# EAGLE design board (EAGLE 4.16)
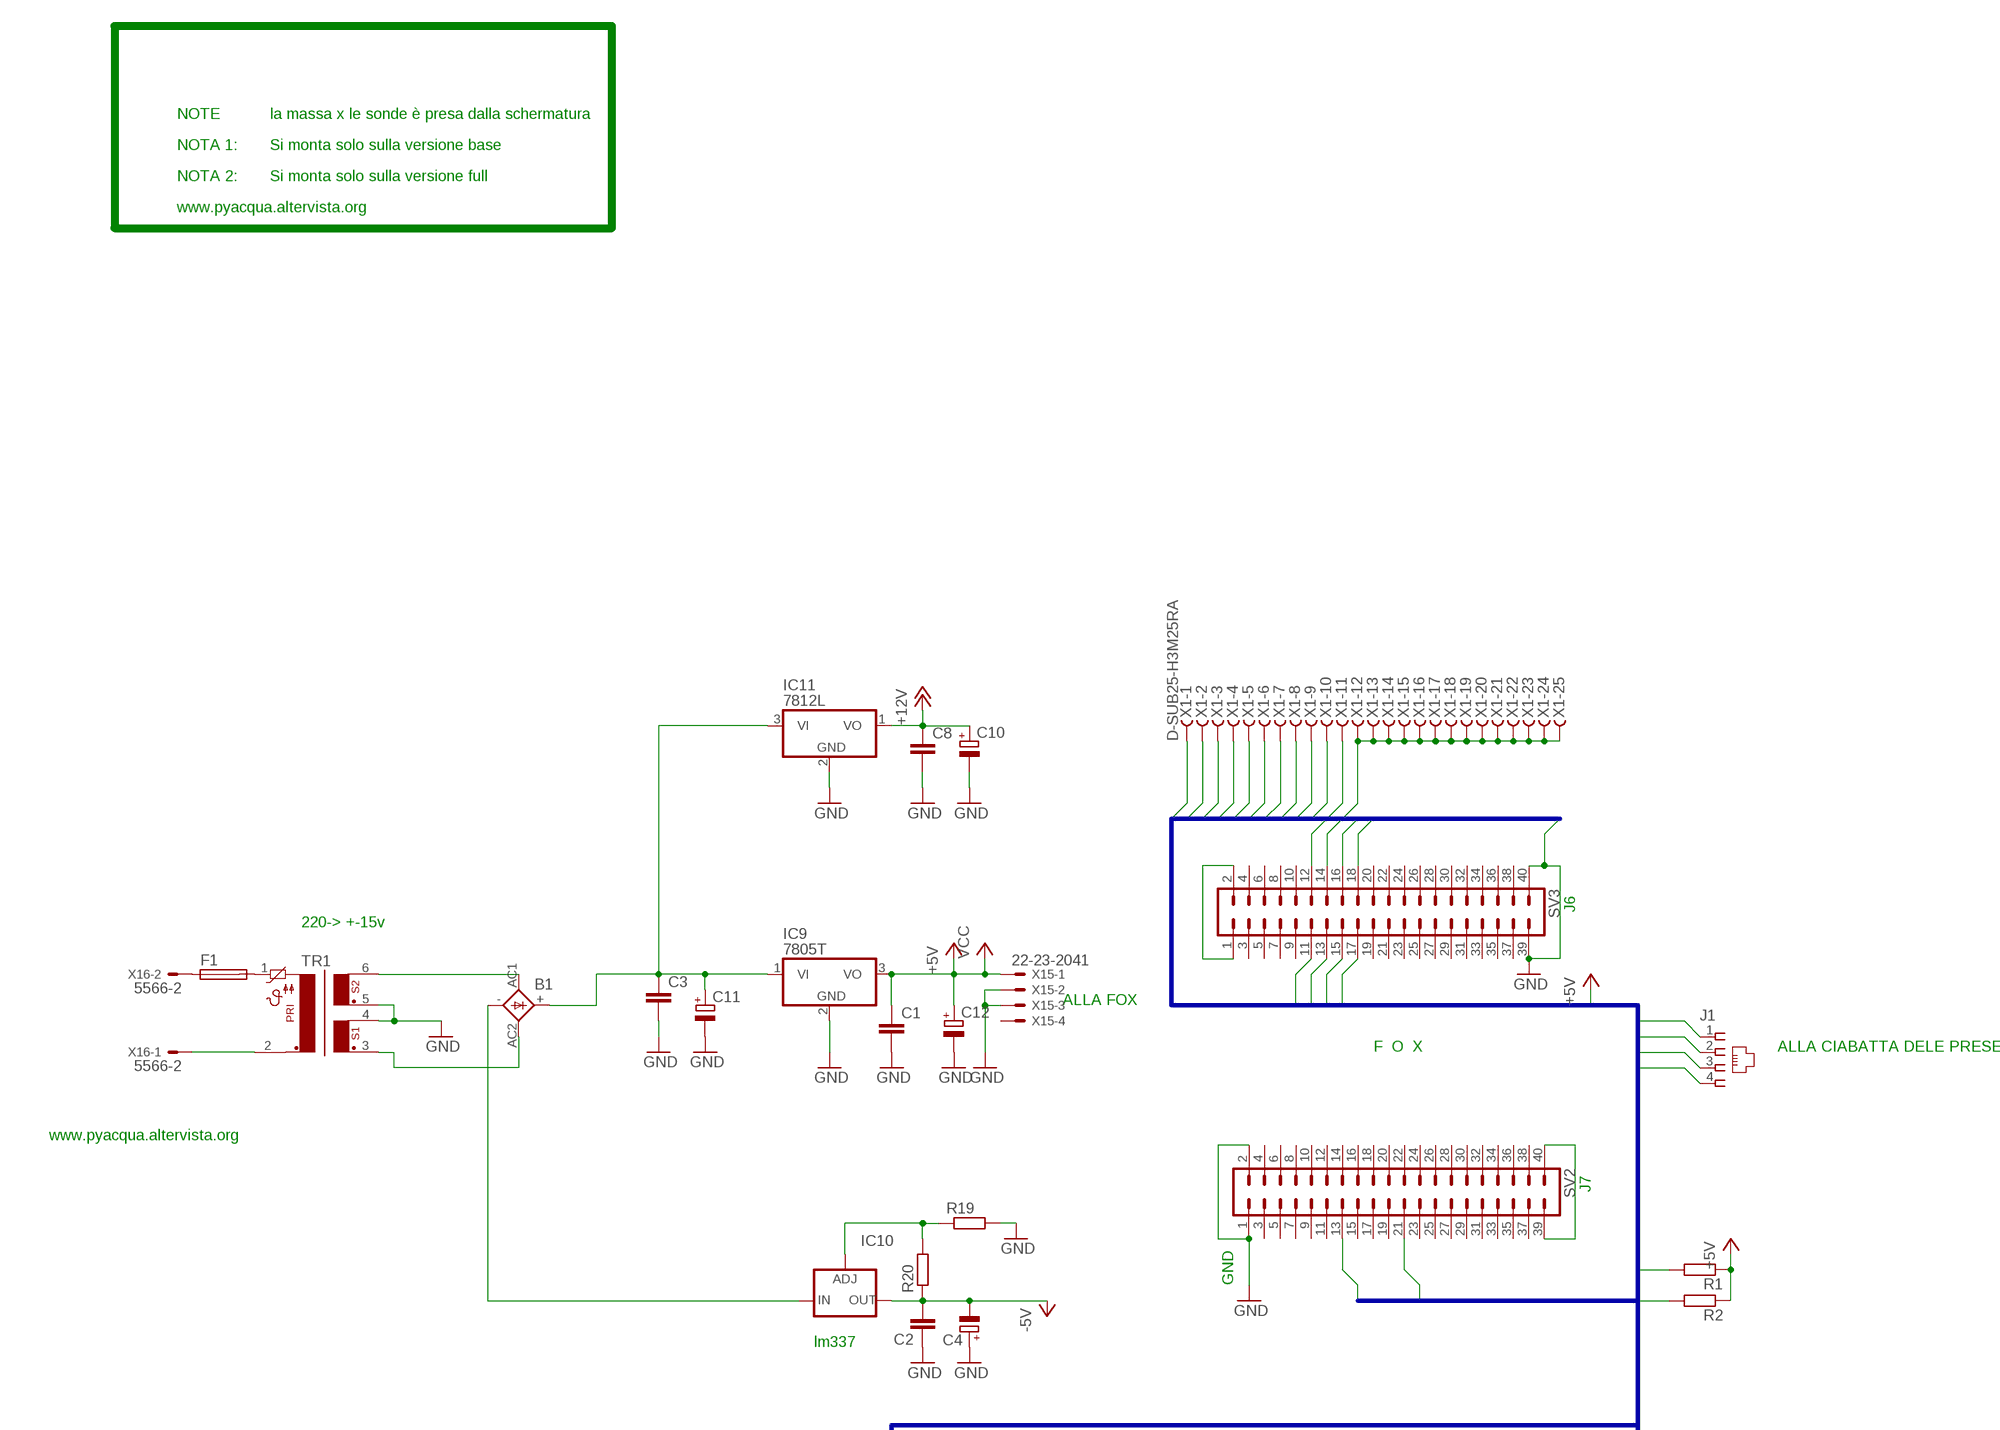
[diagram p0: schematic, sheet 1, part 1 of 3]
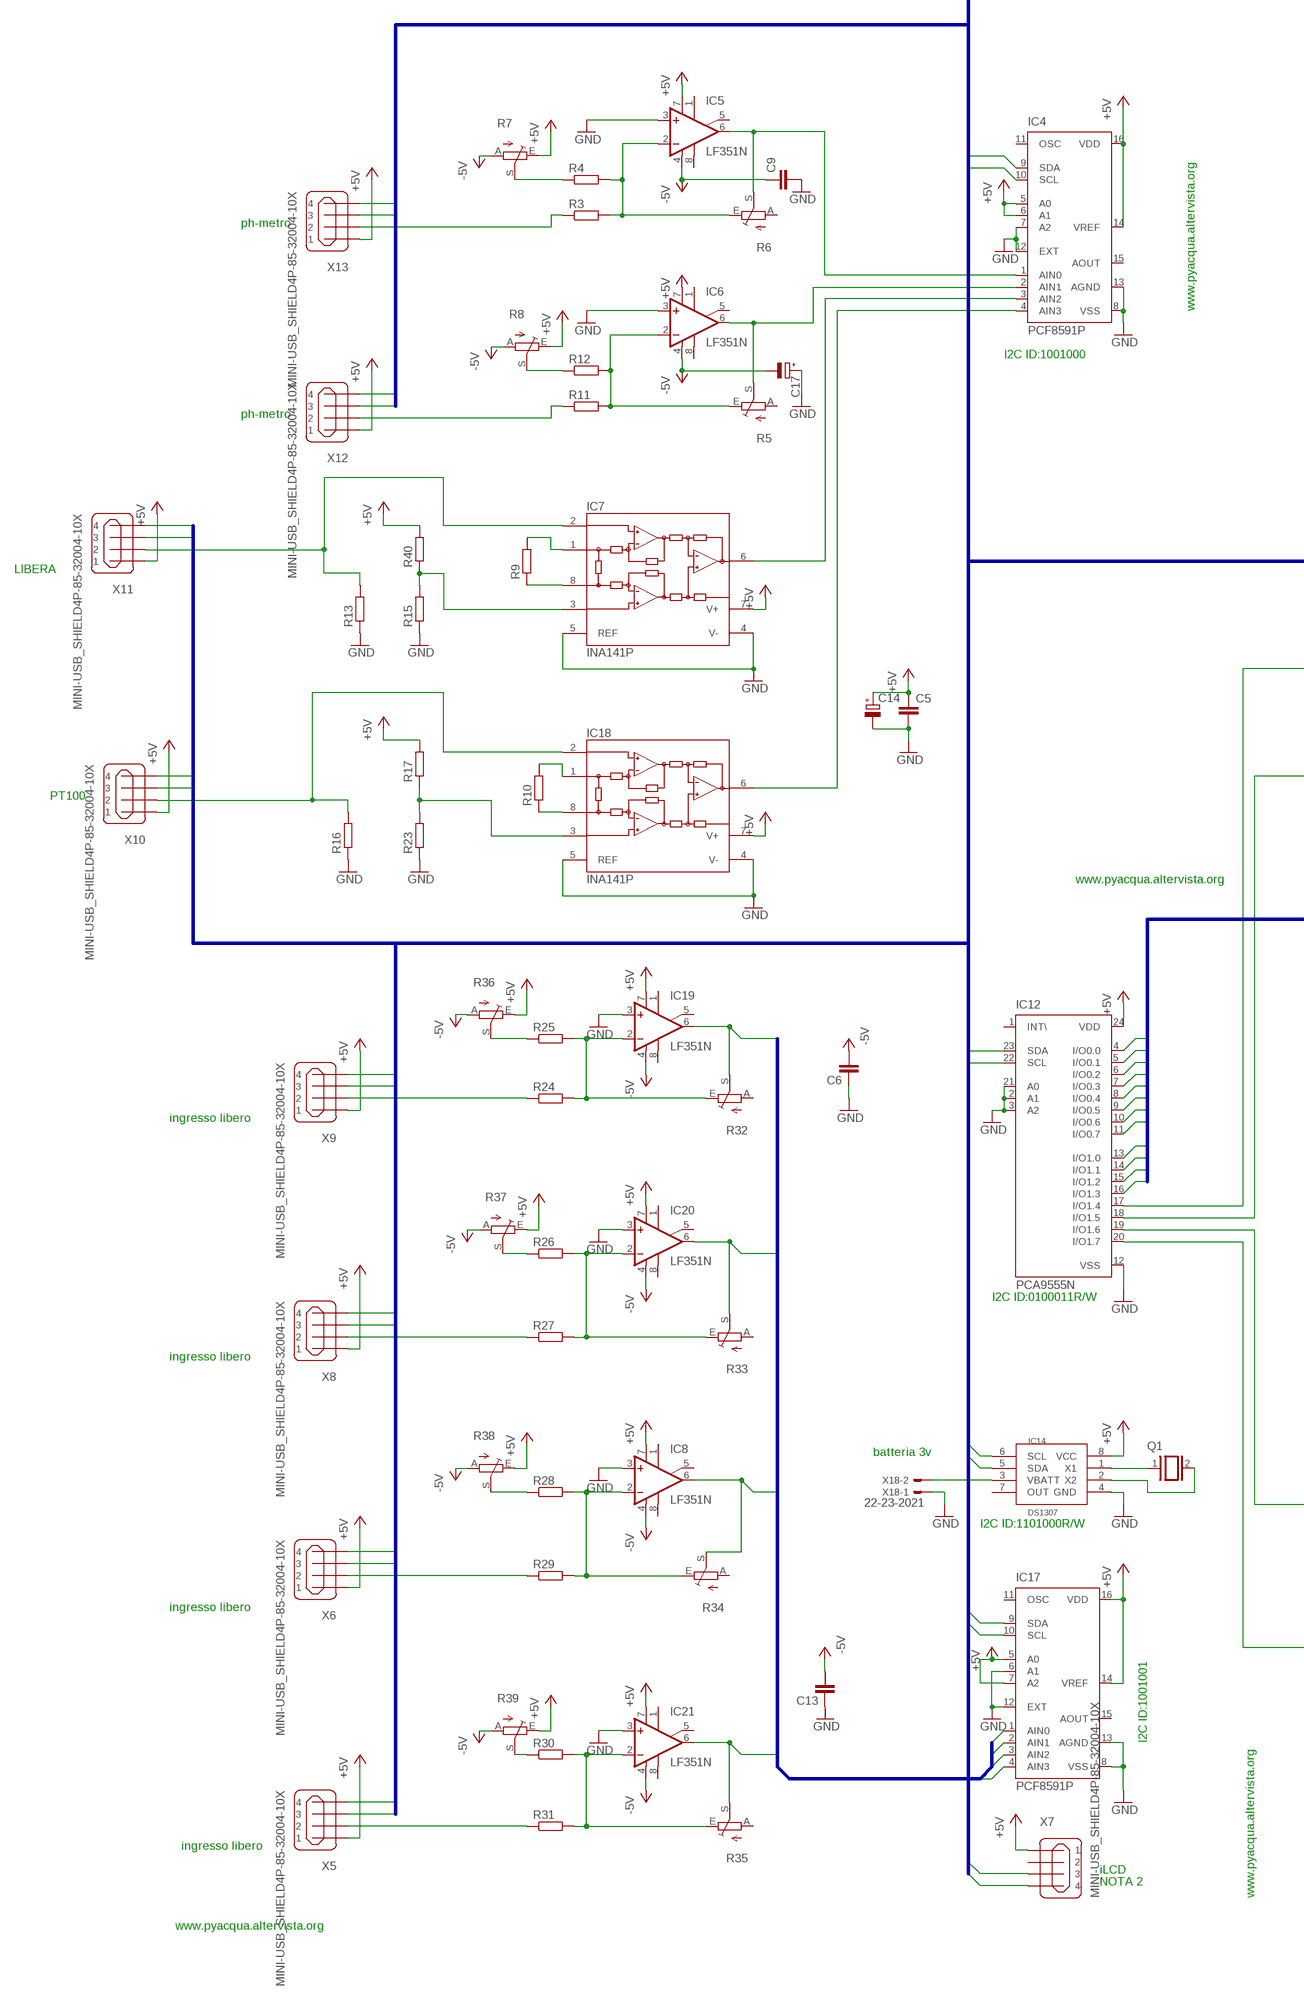
[diagram p1: schematic, sheet 1, part 2 of 3]
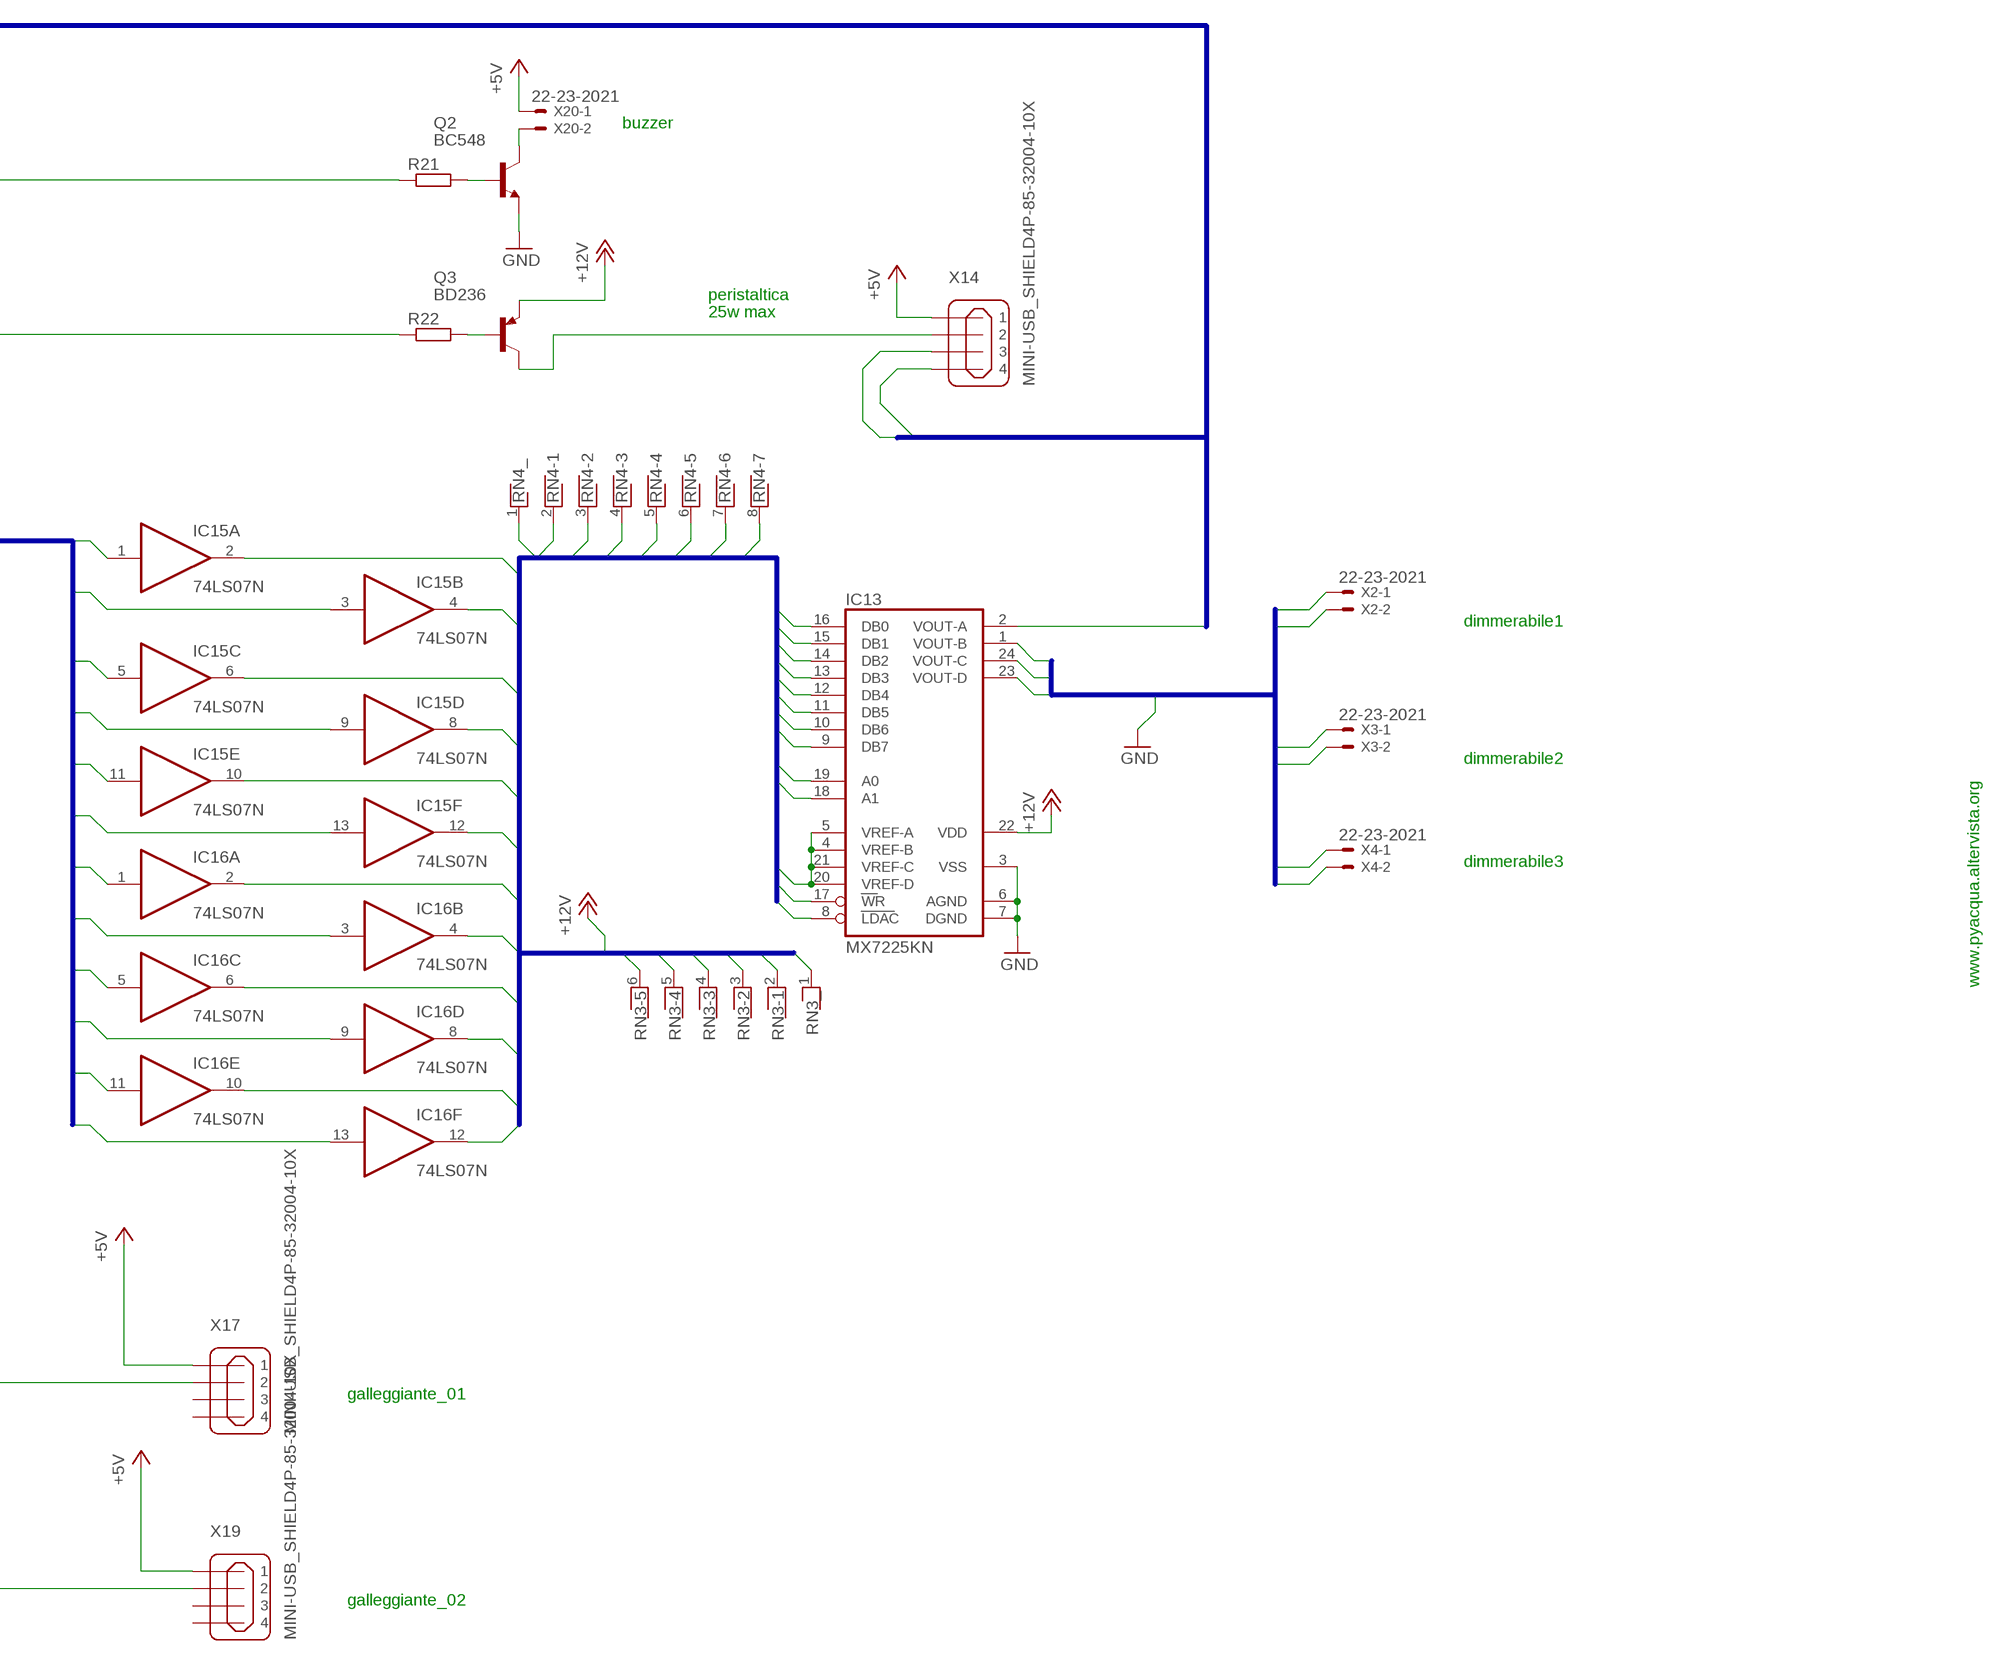
[diagram p2: schematic, sheet 1, part 3 of 3]

## Parts
B1  2KBP  [2KBP]
C1  C-EU025-040X050  [C025-040X050]
C2  C-EU025-040X050  [C025-040X050]
C3  C-EU025-040X050  [C025-040X050]
C4  CPOL-EUE2-5  [E2-5]
C5  C-EU025-040X050  [C025-040X050]
C6  C-EU025-060X050  [C025-060X050]
C8  C-EU025-050X050  [C025-050X050]
C9  C-EU025-040X050  [C025-040X050]
C10  CPOL-EUE2-5  [E2-5]
C11  CPOL-EUE2.5-6  [E2,5-6]
C12  CPOL-EUE2.5-6  [E2,5-6]
C13  C-EU025-060X050  [C025-060X050]
C14  CPOL-EUE2.5-6  [E2,5-6]
C17  CPOL-EUE2.5-6  [E2,5-6]
F1  GSH15  [GSH15]
IC4  PCF8591P  [DIL16]
IC5  LF351N  [DIL08]
IC6  LF351N  [DIL08]
IC7  INA141P  [DIL08]
IC8  LF351N  [DIL08]
IC9  7805T  [TO220H]
IC10  LM337L  [337L]
IC11  7812L  [TO92]
IC12  PCA9555N  [DIL24-6]
IC13  MX7225KN  [DIL24-6]
IC14  DS1307  [DS1307]
IC15  74LS07N  [DIL14]
IC16  74LS07N  [DIL14]
IC17  PCF8591P  [DIL16]
IC18  INA141P  [DIL08]
IC19  LF351N  [DIL08]
IC20  LF351N  [DIL08]
IC21  LF351N  [DIL08]
J1  520242-2  [520242-2]
Q1  XTAL  [Q]
Q2  BC548  [TO92-EBC]
Q3  BD236  [TO126]
R1  R-EU_0207/10  [0207/10]
R2  R-EU_0207/10  [0207/10]
R3  R-EU_0207/10  [0207/10]
R4  R-EU_0207/10  [0207/10]
R5  TRIM_EU-CT6  [CT6]
R6  TRIM_EU-CT6  [CT6]
R7  TRIM_EU-B25P  [B25P]
R8  TRIM_EU-B25P  [B25P]
R9  R-EU_0207/10  [0207/10]
R10  R-EU_0207/10  [0207/10]
R11  R-EU_0207/10  [0207/10]
R12  R-EU_0207/10  [0207/10]
R13  R-EU_0207/10  [0207/10]
R15  R-EU_0207/10  [0207/10]
R16  R-EU_0207/10  [0207/10]
R17  R-EU_0207/10  [0207/10]
R19  R-EU_0207/10  [0207/10]
R20  R-EU_0207/10  [0207/10]
R21  R-EU_0207/10  [0207/10]
R22  R-EU_0207/10  [0207/10]
R23  R-EU_0207/10  [0207/10]
R24  R-EU_0207/10  [0207/10]
R25  R-EU_0207/10  [0207/10]
R26  R-EU_0207/10  [0207/10]
R27  R-EU_0207/10  [0207/10]
R28  R-EU_0207/10  [0207/10]
R29  R-EU_0207/10  [0207/10]
R30  R-EU_0207/10  [0207/10]
R31  R-EU_0207/10  [0207/10]
R32  TRIM_EU-CT6  [CT6]
R33  TRIM_EU-CT6  [CT6]
R34  TRIM_EU-CT6  [CT6]
R35  TRIM_EU-CT6  [CT6]
R36  TRIM_EU-B25P  [B25P]
R37  TRIM_EU-B25P  [B25P]
R38  TRIM_EU-B25P  [B25P]
R39  TRIM_EU-B25P  [B25P]
R40  R-EU_0207/10  [0207/10]
RN3  RNX5  [RN-6]
RN4  RNX7  [RN-8]
SV2  MA20-2  [MA20-2]
SV3  MA20-2  [MA20-2]
TR1  PT07,5-2  [PT07,5-2]
X1  D-SUB25-H3M25RA  [H3M25RA]
X2  22-23-2021  [22-23-2021]
X3  22-23-2021  [22-23-2021]
X4  22-23-2021  [22-23-2021]
X5  MINI-USB_SHIELD4P-85-32004-10X  [85-32004-10X]
X6  MINI-USB_SHIELD4P-85-32004-10X  [85-32004-10X]
X7  MINI-USB_SHIELD4P-85-32004-10X  [85-32004-10X]
X8  MINI-USB_SHIELD4P-85-32004-10X  [85-32004-10X]
X9  MINI-USB_SHIELD4P-85-32004-10X  [85-32004-10X]
X10  MINI-USB_SHIELD4P-85-32004-10X  [85-32004-10X]
X11  MINI-USB_SHIELD4P-85-32004-10X  [85-32004-10X]
X12  MINI-USB_SHIELD4P-85-32004-10X  [85-32004-10X]
X13  MINI-USB_SHIELD4P-85-32004-10X  [85-32004-10X]
X14  MINI-USB_SHIELD4P-85-32004-10X  [85-32004-10X]
X15  22-23-2041  [22-23-2041]
X16  5566-2  [5566-2]
X17  MINI-USB_SHIELD4P-85-32004-10X  [85-32004-10X]
X18  22-23-2021  [22-23-2021]
X19  MINI-USB_SHIELD4P-85-32004-10X  [85-32004-10X]
X20  22-23-2021  [22-23-2021]

## Nets
12V: IC13.4(VREF-B) IC13.5(VREF-A) IC13.20(VREF-D) IC13.21(VREF-C) RN3.1 RN4.1 ; supply symbol labelled +12V
+5V: C1.1 C5.1 C12.+ C14.+ IC4.5(A0) IC4.6(A1) IC4.14(VREF) IC4.16(VDD) IC5.7(V+) IC6.7(V+) IC7.7(V+) IC8.7(V+) IC9.3(VO) IC12.24(VDD) IC14.8(VCC) IC17.5(A0) IC17.7(A2) IC17.14(VREF) IC17.16(VDD) IC18.7(V+) IC19.7(V+) IC20.7(V+) IC21.7(V+) R1.1 R2.1 R7.E R8.E R17.2 R36.E R37.E R38.E R39.E R40.2 X5.1 X6.1 X7.1 X8.1 X9.1 X10.1 X11.1 X12.1 X13.1 X14.1 X15.1 X17.1 X19.1 X20.1 ; supply symbol labelled VCC
+12V: C8.1 C10.+ IC11.1(VO) IC13.22(VDD)
-5V: C2.2 C4.- C6.2 C9.1 C13.2 C17.- IC5.4(V-) IC6.4(V-) IC8.4(V-) IC10.OUT IC19.4(V-) IC20.4(V-) IC21.4(V-) R7.A R8.A R20.1 R36.A R37.A R38.A R39.A
A0: IC12.13(I/O1.0) IC13.19(A0) IC16.5(C:I) IC16.6(C:O) RN4.2
A1: IC12.14(I/O1.1) IC13.18(A1) IC16.8(D:O) IC16.9(D:I) RN4.3
CH0: IC17.1(AIN0) IC21.6(OUT) R35.S
CH1: IC8.6(OUT) IC17.2(AIN1) R34.S
CH2: IC17.3(AIN2) IC20.6(OUT) R33.S
CH3: IC17.4(AIN3) IC19.6(OUT) R32.S
CONTRASTO: IC13.2(VOUT-A) X1.5
DATA0: IC13.16(DB0) IC15.2(A:O) RN4.5
DATA1: IC13.15(DB1) IC15.4(B:O) RN4.6
DATA2: IC13.14(DB2) IC15.6(C:O) RN4.7
DATA3: IC13.13(DB3) IC15.8(D:O) RN4.8
DATA4: IC13.12(DB4) IC15.10(E:O) RN3.6 SV3.14 X1.8
DATA5: IC13.11(DB5) IC15.12(F:O) RN3.5 SV3.13 X1.9
DATA6: IC13.10(DB6) IC16.2(A:O) RN3.4 SV3.11 SV3.16 X1.10
DATA7: IC13.9(DB7) IC16.4(B:O) RN3.3 SV3.15 X1.11
DB0: IC12.4(I/O0.0) IC15.1(A:I)
DB1: IC12.5(I/O0.1) IC15.3(B:I)
DB2: IC12.6(I/O0.2) IC15.5(C:I)
DB3: IC12.7(I/O0.3) IC15.9(D:I)
DB4: IC12.8(I/O0.4) IC15.11(E:I)
DB5: IC12.9(I/O0.5) IC15.13(F:I)
DB6: IC12.10(I/O0.6) IC16.1(A:I)
DB7: IC12.11(I/O0.7) IC16.3(B:I)
DIM1: IC13.1(VOUT-B) X2.1
DIM2: IC13.24(VOUT-C) X3.1
DIM3: IC13.23(VOUT-D) X4.1
E: SV3.17 X1.6
GND: C1.2 C2.1 C3.2 C4.+ C5.2 C6.1 C8.2 C9.2 C10.- C11.- C12.- C13.1 C14.- C17.+ IC4.7(A2) IC4.8(VSS) IC4.12(EXT) IC4.13(AGND) IC5.3(+IN) IC6.3(+IN) IC7.4(V-) IC7.5(REF) IC8.3(+IN) IC9.2(GND) IC11.2(GND) IC12.2(A1) IC12.3(A2) IC12.12(VSS) IC12.21(A0) IC13.3(VSS) IC13.6(AGND) IC13.7(DGND) IC14.4(GND) IC17.6(A1) IC17.8(VSS) IC17.12(EXT) IC17.13(AGND) IC18.4(V-) IC18.5(REF) IC19.3(+IN) IC20.3(+IN) IC21.3(+IN) J1.1 Q2.E R13.1 R15.1 R16.1 R19.2 R23.1 SV2.1 SV2.2 SV3.39 SV3.40 TR1.4 TR1.5 X1.3 X1.12 X1.13 X1.14 X1.15 X1.16 X1.17 X1.18 X1.19 X1.20 X1.21 X1.22 X1.23 X1.24 X1.25 X2.2 X3.2 X4.2 X15.2 X15.3 X18.1
LDAC: IC12.16(I/O1.3) IC13.8(LDAC) IC16.12(F:O) IC16.13(F:I) RN3.2
N$1: IC12.17(I/O1.4) R21.1
N$2: TR1.2 X16.1
N$3: F1.2 TR1.1
N$4: IC7.8(J) R9.1
N$5: IC7.1(J) R9.2
N$6: IC18.8(J) R10.1
N$7: IC18.1(J) R10.2
N$8: IC12.19(I/O1.6) X17.2
N$9: IC4.1(AIN0) IC5.6(OUT) R6.S
N$10: IC4.2(AIN1) IC6.6(OUT) R5.S
N$11: IC12.20(I/O1.7) X19.2
N$13: IC4.3(AIN2) IC7.6(OUT)
N$22: IC4.4(AIN3) IC18.6(OUT)
N$26: Q2.B R21.2
N$27: Q2.C X20.2
N$31: R8.S R12.1
N$35: B1.AC1 TR1.6
N$40: Q3.3(B) R22.2
N$42: Q3.1(E)
N$51: IC12.18(I/O1.5) R22.1
N$58: IC5.2(-IN) R3.2 R4.2 R6.E
N$60: R3.1 X13.2
N$61: Q3.2(C) X14.2
N$62: R4.1 R7.S
N$63: IC6.2(-IN) R5.E R11.2 R12.2
N$66: IC7.3(+IN) R15.2 R40.1
N$67: B1.- IC10.IN
N$68: IC7.2(-IN) R13.2 X11.2
N$69: R11.1 X12.2
N$70: SV3.1 SV3.2
N$71: SV2.39 SV2.40
N$74: IC14.3(VBATT) X18.2
N$76: B1.+ C3.1 C11.+ IC9.1(VI) IC11.3(VI)
N$77: IC10.ADJ R19.1 R20.2
N$80: B1.AC2 TR1.3
N$83: IC14.1(X1) Q1.1
N$84: IC14.2(X2) Q1.2
N$85: F1.1 X16.2
N$107: IC18.3(+IN) R17.1 R23.2
N$110: IC18.2(-IN) R16.2 X10.2
N$113: IC19.2(-IN) R24.2 R25.2 R32.E
N$114: IC20.2(-IN) R26.2 R27.2 R33.E
N$115: IC8.2(-IN) R28.2 R29.2 R34.E
N$116: IC21.2(-IN) R30.2 R31.2 R35.E
N$117: R31.1 X5.2
N$119: R29.1 X6.2
N$121: R30.1 R39.S
N$122: R28.1 R38.S
N$123: R26.1 R37.S
N$124: R27.1 X8.2
N$125: R24.1 X9.2
N$126: R25.1 R36.S
RS: SV3.18 X1.7
SCL: IC4.10(SCL) IC12.22(SCL) IC14.6(SCL) IC17.10(SCL) J1.2 R2.2 SV2.13 X1.2 X5.4 X6.4 X7.4 X8.4 X9.4 X10.4 X11.4 X12.4 X13.4 X14.4
SDA: IC4.9(SDA) IC12.23(SDA) IC14.5(SDA) IC17.9(SDA) J1.3 R1.2 SV2.21 X1.1 X5.3 X6.3 X7.3 X8.3 X9.3 X10.3 X11.3 X12.3 X13.3 X14.3
VCC: J1.4 SV3.12 X1.4
WR: IC12.15(I/O1.2) IC13.17(WR) IC16.10(E:O) IC16.11(E:I) RN4.4
Unconnected: IC4.11(OSC) IC4.15(AOUT) IC5.1(ON1) IC5.5(ON2) IC5.8(OPT) IC6.1(ON1) IC6.5(ON2) IC6.8(OPT) IC8.1(ON1) IC8.5(ON2) IC8.8(OPT) IC12.1(INT\) IC14.7(OUT) IC17.11(OSC) IC17.15(AOUT) IC19.1(ON1) IC19.5(ON2) IC19.8(OPT) IC20.1(ON1) IC20.5(ON2) IC20.8(OPT) IC21.1(ON1) IC21.5(ON2) IC21.8(OPT) R5.A R6.A R32.A R33.A R34.A R35.A SV2.3 SV2.4 SV2.5 SV2.6 SV2.7 SV2.8 SV2.9 SV2.10 SV2.11 SV2.12 SV2.14 SV2.15 SV2.16 SV2.17 SV2.18 SV2.19 SV2.20 SV2.22 SV2.23 SV2.24 SV2.25 SV2.26 SV2.27 SV2.28 SV2.29 SV2.30 SV2.31 SV2.32 SV2.33 SV2.34 SV2.35 SV2.36 SV2.37 SV2.38 SV3.3 SV3.4 SV3.5 SV3.6 SV3.7 SV3.8 SV3.9 SV3.10 SV3.19 SV3.20 SV3.21 SV3.22 SV3.23 SV3.24 SV3.25 SV3.26 SV3.27 SV3.28 SV3.29 SV3.30 SV3.31 SV3.32 SV3.33 SV3.34 SV3.35 SV3.36 SV3.37 SV3.38 X5.M1(S1) X5.M2(S2) X6.M1(S1) X6.M2(S2) X7.2 X7.M1(S1) X7.M2(S2) X8.M1(S1) X8.M2(S2) X9.M1(S1) X9.M2(S2) X10.M1(S1) X10.M2(S2) X11.M1(S1) X11.M2(S2) X12.M1(S1) X12.M2(S2) X13.M1(S1) X13.M2(S2) X14.M1(S1) X14.M2(S2) X15.4 X17.3 X17.4 X17.M1(S1) X17.M2(S2) X19.3 X19.4 X19.M1(S1) X19.M2(S2)

## Buses
BUS:SDA,SCL,GND,VCC,DATA[4..7],CONTRASTO,E,RS
BUS_01:DB[0..7],A[0..1],WR,LDAC
BUS_02:DATA[0..7],A[0..1],WR,LDAC,12V
AN:CH[0..3]
DIMMER:DIM[1..3],GND

## Notes on the sheet
- NOTE | la massa x le sonde è presa dalla schermatura
- NOTA 1: | Si monta solo sulla versione base
- NOTA 2: | Si monta solo sulla versione full
- www.pyacqua.altervista.org
- J6
- 220-> +-15v
- ALLA FOX
- F  O  X | ALLA CIABATTA DELE PRESE
- www.pyacqua.altervista.org
- J7
- GND
- lm337
- ph-metro
- www.pyacqua.altervista.org
- I2C ID:1001000
- ph-metro
- LIBERA
- buzzer
- peristaltica
- 25w max
- PT100
- www.pyacqua.altervista.org
- dimmerabile1
- dimmerabile2
- ingresso libero
- dimmerabile3
- www.pyacqua.altervista.org
- I2C ID:0100011R/W
- ingresso libero
- batteria 3v
- galleggiante_01
- I2C ID:1101000R/W
- ingresso libero
- galleggiante_02
- I2C ID:1001001
- ingresso libero
- iLCD
- NOTA 2
- www.pyacqua.altervista.org
- www.pyacqua.altervista.org

## Power pins joined to a net without a drawn wire
+5V: IC15.14(P:VCC) IC16.14(P:VCC)
GND: IC15.7(P:GND) IC16.7(P:GND)

## Library data of the parts
B1 = rectifier:2KBP: RECTIFIER grid 3 x 3,81 mm
C1-C3 C5 C6 C8 C9 C13 = rcl:C-EU: CAPACITOR, European symbol
C4 C10-C12 C14 C17 = rcl:CPOL-EU: POLARIZED CAPACITOR, European symbol
F1 = fuse:GSH15: FUSE HOLDER grid 15mm, 19649 Wickmann
IC4 IC17 = micro-philips:PCF8591: I2C-Bus D/A CONVERTER
IC5 IC6 IC8 IC19-IC21 = linear:LF351: OP AMP
IC7 IC18 = burr-brown:INA141: Instrumentation Amplifier Precision, Low Power, G = 10, 100
IC9 IC11 = linear:78*: Positive VOLTAGE REGULATOR Source: http://cache.national.com/ds/LM/LM78L05.pdf http://www.fairchildsemi.com/ds/LM/LM7805.pdf
IC10 = v-reg:LM337L: VOLTAGE REGULATOR
IC12 = micro-philips:PCA9555: 16-bit I2C and SMBus I/O port with interrupt Source: PCA9555_5.pdf
IC13 = maxim:MX7225KN: DIGITAL/ANALOG CONVERTER
IC14 = aggiunte:DS1307: DS1307 I2C DEVICE
IC15 IC16 = 74xx-us:74*07: Hex BUFFER, open collector high-voltage output
J1 = con-amp:520242-2: AMP connector
Q1 = special:XTAL: CRYSTAL
Q2 = transistor-npn:BC548*: NPN Transistor
Q3 = transistor-pnp:BD236: PNP Transistor
R1-R4 R9-R13 R15-R17 R19-R31 R40 = rcl:R-EU_: RESISTOR, European symbol
R5-R8 R32-R39 = pot:TRIM_EU-: POTENTIOMETER
RN3 = resistor-net:RNX5: RESISTOR NETWORK
RN4 = resistor-net:RNX7: RESISTOR NETWORK
SV2 SV3 = con-lstb:MA20-2: PIN HEADER
TR1 = trafo:PT07,5-2: TRANSFORMER 1 primary winding, temp. protection fuse, 2 secondary windings, mounting holes BLOCK
X1 = con-thomas-betts:D-SUB25-: D-Subminiatur Connector Source: Electronioc Interconnects European Edition 1998
X2-X4 X18 X20 = con-molex:22-23-2021: .100" (2.54mm) Center Header - 2 Pin
X5-X14 X17 X19 = con-cypressindustries:MINI-USB_SHIELD4P-: MINI USB 4 Pol. Source: www.cypressindustries.com
X15 = con-molex:22-23-2041: .100" (2.54mm) Center Header - 4 Pin
X16 = con-molex:5566-2: Mini FIT connector 2 pol Source: http://www.molex.com

## Board
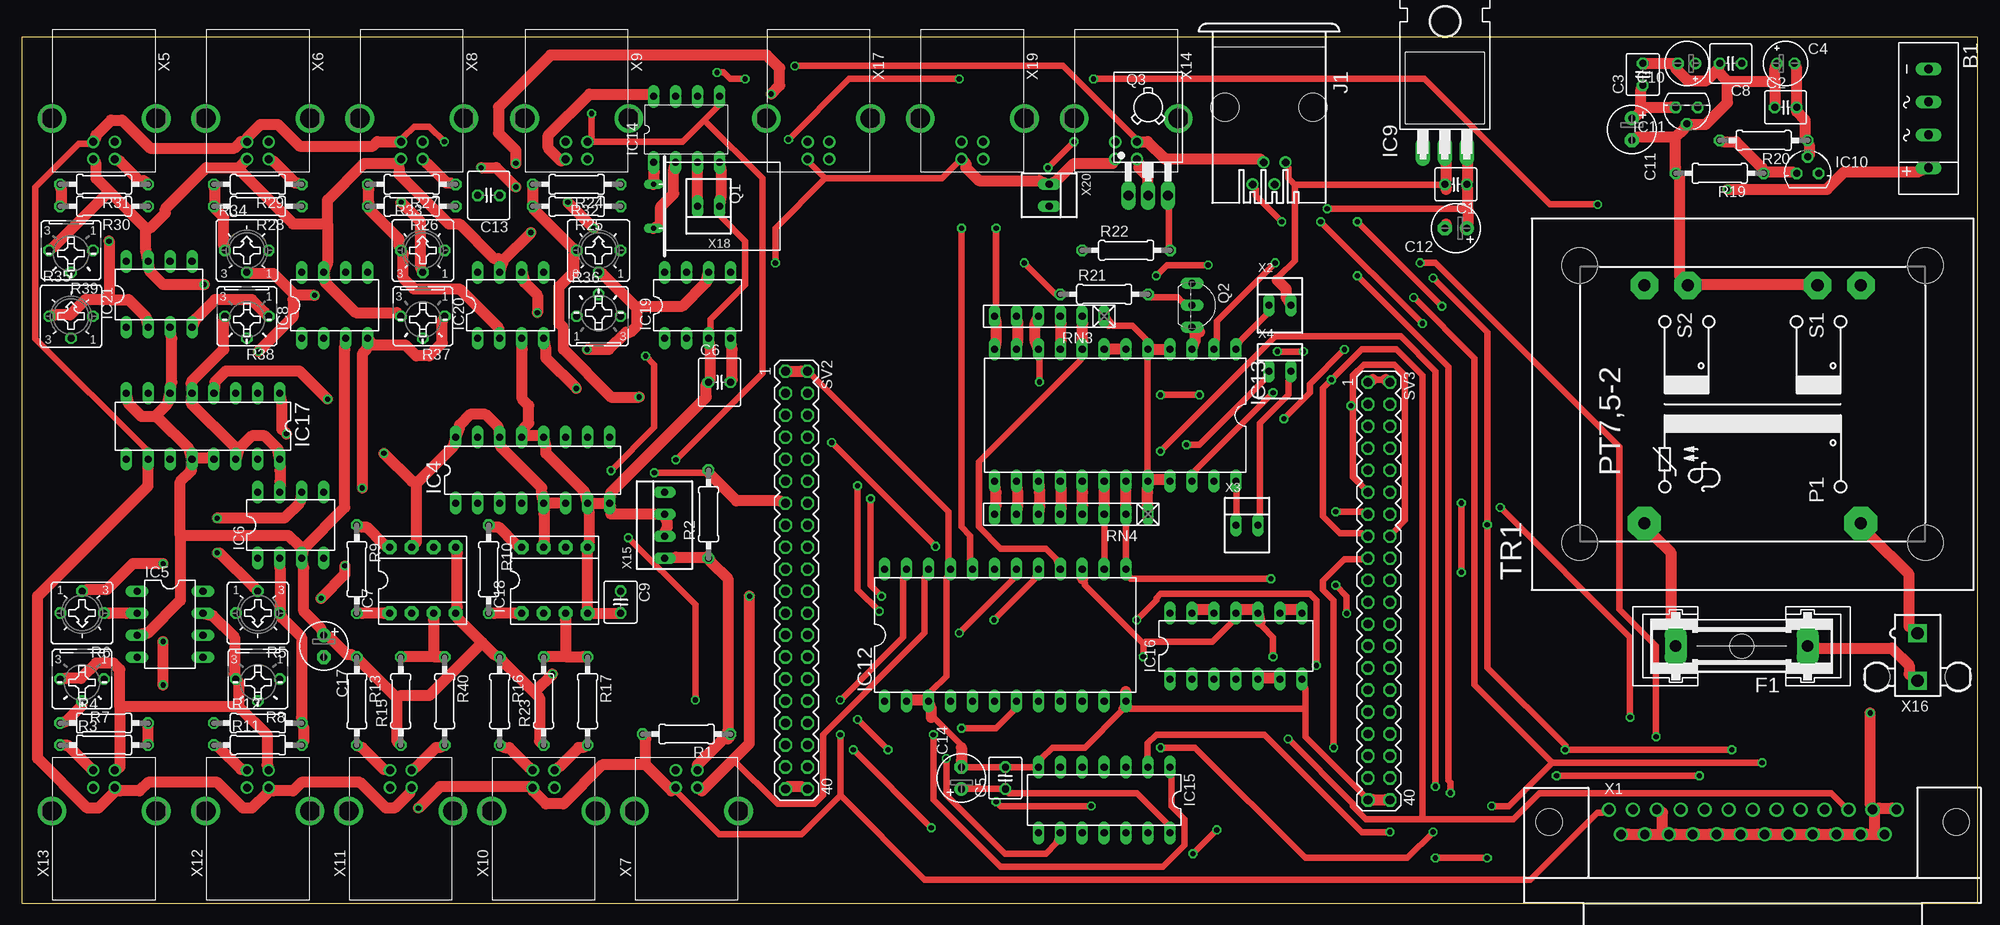
[diagram p3: board, top side]
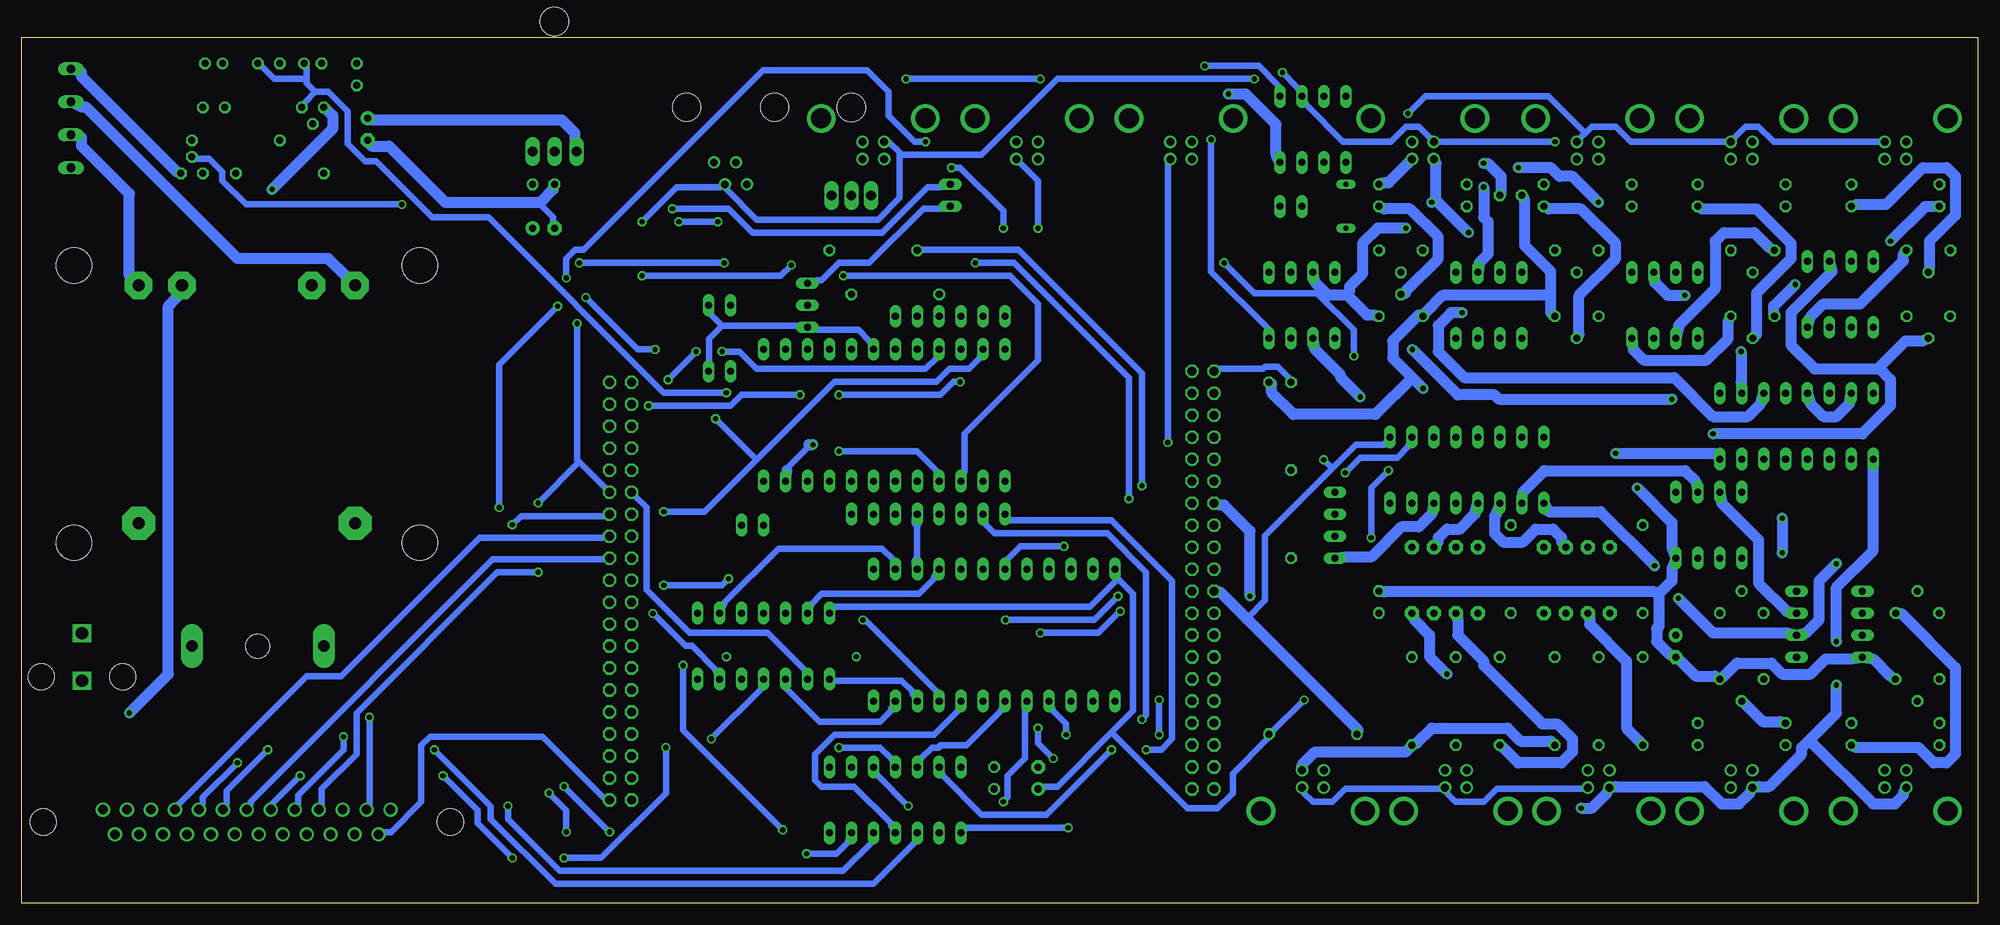
[diagram p4: board, bottom side, seen from below]

Size 226.04 x 100 mm. Coordinates in mm from the lower left corner, seen from the top.
Outline: 0,0 226.04,0 226.04,100 0,100 0,0
Copper layers (1*16): Top 0.035mm / dielectric 1.5mm / Bottom 0.035mm
Design rules "design rules": minimum track width 30mil, minimum drill 24mil, track to track 20mil, track to pad 20mil, pad to pad 20mil, via to via 20mil, smd to smd 20mil, copper to edge 40mil, drill to drill 8mil, minimum pad ring 10mil, minimum via ring 8mil, stop-mask expansion 4mil, vias tented up to drill 0mil, thermal gap 10mil

### Footprints (pad centres in the part's own frame; a part is rotated, then mirrored left to right if it is on the bottom)
2KBP = drill 1.016 long: + 5.715,0; - -5.715,0; AC1 -1.905,0; AC2 1.905,0
C025-040X050 = drill 0.813 octagon: 1 -1.27,0; 2 1.27,0
E2-5 = drill 0.813 pad 1.27 round: + -1.016,0 | drill 0.813 pad 1.27 octagon: - 1.016,0
C025-060X050 = drill 0.813 octagon: 1 -1.27,0; 2 1.27,0
C025-050X050 = drill 0.813 octagon: 1 -1.27,0; 2 1.27,0
E2,5-6 = drill 0.813 pad 1.6 round: + -1.27,0 | drill 0.813 pad 1.6 octagon: - 1.27,0
GSH15 = drill 1.321 pad 2.54 long: 1 -7.62,0; 2 7.62,0 | hole 2.794: 0,0
DIL16 = drill 0.813 long: 1 -8.89,-3.81; 2 -6.35,-3.81; 3 -3.81,-3.81; 4 -1.27,-3.81; 5 1.27,-3.81; 6 3.81,-3.81; 7 6.35,-3.81; 8 8.89,-3.81; 9 8.89,3.81; 10 6.35,3.81; 11 3.81,3.81; 12 1.27,3.81; 13 -1.27,3.81; 14 -3.81,3.81; 15 -6.35,3.81; 16 -8.89,3.81
DIL08 = drill 0.813 long: 1 -3.81,-3.81; 2 -1.27,-3.81; 3 1.27,-3.81; 4 3.81,-3.81; 5 3.81,3.81; 6 1.27,3.81; 7 -1.27,3.81; 8 -3.81,3.81
DIL08' = drill 0.813 pad 1.6 octagon: 1 -3.81,-3.81; 2 -1.27,-3.81; 3 1.27,-3.81; 4 3.81,-3.81; 5 3.81,3.81; 6 1.27,3.81; 7 -1.27,3.81; 8 -3.81,3.81
TO220H = drill 1.118 long: 1 -2.54,-10.16; 2 0,-10.16; 3 2.54,-10.16 | hole 3.302: 0,4.826
337L = drill 0.813 octagon: ADJ -1.27,0; IN 1.27,0; OUT 0,1.905
TO92 = drill 0.813 octagon: 1 -1.27,0; 2 0,1.905; 3 1.27,0
DIL24-6 = drill 0.813 long: 1 -13.97,-7.62; 2 -11.43,-7.62; 3 -8.89,-7.62; 4 -6.35,-7.62; 5 -3.81,-7.62; 6 -1.27,-7.62; 7 1.27,-7.62; 8 3.81,-7.62; 9 6.35,-7.62; 10 8.89,-7.62; 11 11.43,-7.62; 12 13.97,-7.62; 13 13.97,7.62; 14 11.43,7.62; 15 8.89,7.62; 16 6.35,7.62; 17 3.81,7.62; 18 1.27,7.62; 19 -1.27,7.62; 20 -3.81,7.62; 21 -6.35,7.62; 22 -8.89,7.62; 23 -11.43,7.62; 24 -13.97,7.62
DS1307 = drill 0.8 long: 1 -8.89,-5.08; 2 -6.35,-5.08; 3 -3.81,-5.08; 4 -1.27,-5.08; 5 -1.27,2.54; 6 -3.81,2.54; 7 -6.35,2.54; 8 -8.89,2.54
DIL14 = drill 0.813 long: 1 -7.62,-3.81; 2 -5.08,-3.81; 3 -2.54,-3.81; 4 0,-3.81; 5 2.54,-3.81; 6 5.08,-3.81; 7 7.62,-3.81; 8 7.62,3.81; 9 5.08,3.81; 10 2.54,3.81; 11 0,3.81; 12 -2.54,3.81; 13 -5.08,3.81; 14 -7.62,3.81
520242-2 = drill 0.889 round: 1 -1.905,6.35; 2 -0.635,8.89; 3 0.635,6.35; 4 1.905,8.89 | hole 3.251: -5.08,0; 5.08,0
Q = drill 0.61 long: 1 -2.54,-7.62; 2 2.54,-7.62
TO92-EBC = drill 0.813 long: B 0,-1.27; C -2.54,-1.27; E 2.54,-1.27
TO126 = drill 1.118 long: 1 -2.286,-5.08; 2 0,-5.08; 3 2.286,-5.08 | hole 3.302: 0,5.08
0207/10 = drill 0.813 octagon: 1 -5.08,0; 2 5.08,0
CT6 = drill 0.813 octagon: A 2.515,0; E -2.515,0; S 0,-2.54
B25P = drill 0.813 octagon: A -2.54,0; E 2.54,0; S 0,2.54
RN-6 = drill 0.813 long: 1 -6.35,0; 2 -3.81,0; 3 -1.27,0; 4 1.27,0; 5 3.81,0; 6 6.35,0
RN-8 = drill 0.813 long: 1 -8.89,0; 2 -6.35,0; 3 -3.81,0; 4 -1.27,0; 5 1.27,0; 6 3.81,0; 7 6.35,0; 8 8.89,0
MA20-2 = drill 1.016 octagon: 1 -24.13,-1.27; 2 -24.13,1.27; 3 -21.59,-1.27; 4 -21.59,1.27; 5 -19.05,-1.27; 6 -19.05,1.27; 7 -16.51,-1.27; 8 -16.51,1.27; 9 -13.97,-1.27; 10 -13.97,1.27; 11 -11.43,-1.27; 12 -11.43,1.27; 13 -8.89,-1.27; 14 -8.89,1.27; 15 -6.35,-1.27; 16 -6.35,1.27; 17 -3.81,-1.27; 18 -3.81,1.27; 19 -1.27,-1.27; 20 -1.27,1.27; 21 1.27,-1.27; 22 1.27,1.27; 23 3.81,-1.27; 24 3.81,1.27; 25 6.35,-1.27; 26 6.35,1.27; 27 8.89,-1.27; 28 8.89,1.27; 29 11.43,-1.27; 30 11.43,1.27; 31 13.97,-1.27; 32 13.97,1.27; 33 16.51,-1.27; 34 16.51,1.27; 35 19.05,-1.27; 36 19.05,1.27; 37 21.59,-1.27; 38 21.59,1.27; 39 24.13,-1.27; 40 24.13,1.27
PT07,5-2 = drill 1.397 pad 3.81 octagon: 1 -13.741,12.497; 2 -13.741,-12.497 | drill 1.397 pad 3.175 octagon: 3 13.741,-12.497; 4 13.741,-7.493; 5 13.741,7.493; 6 13.741,12.497 | hole 4.115: -16.002,-19.99; 16.002,-19.99; 16.002,19.99; -16.002,19.99
H3M25RA = drill 1.092 round: 1 -16.612,1.422; 2 -13.843,1.422; 3 -11.074,1.422; 4 -8.306,1.422; 5 -5.537,1.422; 6 -2.769,1.422; 7 0,1.422; 8 2.769,1.422; 9 5.537,1.422; 10 8.306,1.422; 11 11.074,1.422; 12 13.843,1.422; 13 16.612,1.422; 14 -15.227,-1.422; 15 -12.459,-1.422; 16 -9.69,-1.422; 17 -6.921,-1.422; 18 -4.153,-1.422; 19 -1.384,-1.422; 20 1.384,-1.422; 21 4.153,-1.422; 22 6.921,-1.422; 23 9.69,-1.422; 24 12.459,-1.422; 25 15.227,-1.422 | hole 3.048: -23.52,0; 23.52,0
22-23-2021 = drill 0.813 long: 1 -1.27,0; 2 1.27,0
85-32004-10X = drill 0.92 pad 1.27 round: 1 4.71,-1.25; 2 4.71,1.25; 3 2.71,1.25; 4 2.71,-1.25 | drill 2.3 pad 3 round: M1 0,6.02; M2 0,-6.02
22-23-2041 = drill 0.813 long: 1 -3.81,0; 2 -1.27,0; 3 1.27,0; 4 3.81,0
5566-2 = drill 1.4 square: 1 0,-2.75; 2 0,2.75 | hole 3: 4.7,2.29; -4.7,2.29

### Placement (x,y rotation side)
B1  220.34,90.64 270 top
C1  165.73,83.02 180 top
C2  203.83,91.91 0 top
C3  187.32,95.72 90 top
C4  203.83,96.99 0 top
C5  113.66,14.44 90 top
C6  80.64,60.16 0 top
C8  197.48,96.99 180 top
C9  69.21,34.76 270 top
C10  192.4,96.99 180 top
C11  186.05,89.37 270 top
C12  165.73,77.94 180 top
C13  53.97,81.75 180 top
C14  108.58,14.44 90 top
C17  34.92,29.68 270 top
F1  198.75,29.68 180 top
IC4  59.05,50 0 top
IC5  17.14,32.22 270 top
IC6  31.11,43.65 0 top
IC7  INA141P  [DIL08']  46.35,37.3 0 top
IC8  36.19,69.05 0 top
IC9  164.46,96.99 0 top
IC10  206.37,84.29 0 top
IC11  192.4,91.91 180 top
IC12  113.66,30.95 0 top
IC13  126.36,56.35 180 top
IC14  81.91,90.64 0 top
IC15  125.09,11.9 180 top
IC16  140.33,29.68 0 top
IC17  20.95,55.08 180 top
IC18  INA141P  [DIL08']  61.59,37.3 0 top
IC19  78.1,69.05 0 top
IC20  56.51,69.05 0 top
IC21  15.87,70.32 0 top
J1  144.14,91.91 180 top
Q1  80.64,80.48 270 top
Q2  136.52,69.05 270 top
Q3  130.17,86.83 0 top
R1  76.83,19.52 180 top
R2  79.37,44.92 90 top
R3  9.52,18.25 0 top
R4  9.52,20.79 0 top
R5  27.3,33.49 180 top
R6  6.98,33.49 180 top
R7  6.98,25.87 180 top
R8  27.3,25.87 180 top
R9  38.73,38.57 270 top
R10  53.97,38.57 270 top
R11  27.3,18.25 0 top
R12  27.3,20.79 0 top
R13  38.73,23.33 270 top
R15  43.81,23.33 90 top
R16  55.24,23.33 270 top
R17  65.4,23.33 270 top
R19  196.21,84.29 180 top
R20  201.29,88.1 180 top
R21  125.09,70.32 0 top
R22  127.63,75.4 0 top
R23  60.32,23.33 90 top
R24  64.13,83.02 180 top
R25  64.13,80.48 180 top
R26  45.08,80.48 180 top
R27  45.08,83.02 180 top
R28  27.3,80.48 180 top
R29  27.3,83.02 180 top
R30  9.52,80.48 180 top
R31  9.52,83.02 180 top
R32  66.67,75.4 0 top
R33  46.35,75.4 0 top
R34  26.03,75.4 0 top
R35  5.71,67.78 0 top
R36  66.67,67.78 0 top
R37  46.35,67.78 180 top
R38  26.03,67.78 180 top
R39  5.71,75.4 180 top
R40  48.89,23.33 270 top
RN3  118.74,67.78 180 top
RN4  121.28,44.92 180 top
SV2  89.53,37.3 270 top
SV3  156.84,36.03 270 top
TR1  200.02,57.62 90 top
X1  200.02,9.36 0 top
X2  145.41,69.05 0 top
X3  141.6,43.65 0 top
X4  145.41,61.43 0 top
X5  9.52,90.64 270 top
X6  27.3,90.64 270 top
X7  76.83,10.63 90 top
X8  45.08,90.64 270 top
X9  64.13,90.64 270 top
X10  60.32,10.63 90 top
X11  43.81,10.63 90 top
X12  27.3,10.63 90 top
X13  9.52,10.63 90 top
X14  127.63,90.64 270 top
X15  74.29,43.65 90 top
X16  219.07,28.41 180 top
X17  92.07,90.64 270 top
X18  79.37,80.48 180 top
X19  109.85,90.64 270 top
X20  118.74,81.75 270 top

### Tracks (layer width: path | path; a pad name or v marks a point on that pad's centre or on a via)
12V
  Top 0.762: 125.6,66.95 126.1,66.7 128.35,66.7 129.85,65.2 IC13.5 130.1,62.7 130.1,49.95 IC13.20
  Top 1.27: 125.6,66.95 RN3.1 | IC13.4 132.1,63.95 130.6,63.95 IC13.5 | IC13.21 132.1,48.95 130.6,48.95 IC13.20 130.1,47.45 130.1,45.95 RN4.1
+5V  (via drill 0.61)
  Top 0.762: C14.+ 109.35,13.2 113.1,13.2 C5.1 114.1,12.7 128.85,12.7 132.35,9.2 IC15.14 | 92.85,83.7 91.1,85.45 X17.1 | 92.85,83.7 106.35,83.7 108.1,85.45 X19.1 | v150.85,80.2 167.1,80.2 | v77.85,23.45 77.85,34.45 v70.1,42.2 | v68.1,49.95 73.1,54.95 73.1,62.2 v72.1,63.2 | v87.1,73.95 87.1,77.95 92.85,83.7
  Top 1.27: R40.2 48.35,17.95 47.85,17.95 45.6,15.7 X11.1 | R17.2 64.85,17.95 64.35,17.95 62.1,15.7 X10.1 | IC4.5 60.85,46.2 62.35,46.2 IC4.6 | IC18.7 60.35,41.7 60.35,44.95 IC4.5 | 45.6,48.45 45.6,41.7 IC7.7 | 45.6,48.45 49.85,52.7 IC4.16 50.6,54.95 50.6,55.2 51.85,56.45 53.6,56.45 55.1,54.95 IC4.14 55.35,52.7 60.1,47.95 60.1,47.45 IC4.5 | 55.6,74.2 55.6,73.95 IC20.7 | 55.6,74.2 v58.85,77.45 | 11.35,22.7 11.35,15.7 X13.1 | 11.35,22.7 11.35,26.95 10.6,27.7 8.6,27.7 6.85,25.95 5.1,25.95 R7.E | IC5.7 22.1,33.2 24.6,30.7 24.6,26.45 R8.E 25.1,25.45 25.1,22.7 | 25.1,22.7 28.35,19.45 28.35,15.95 X12.1 | 25.1,22.7 11.35,22.7 | 25.1,52.45 26.6,53.95 28.1,53.95 29.6,52.45 IC17.16 29.85,49.95 29.85,48.7 IC6.7 | 25.1,52.45 IC17.14 | R38.E 23.35,67.2 23.35,63.95 19.6,60.2 IC17.5 19.6,57.7 24.6,52.7 25.1,52.45 | R37.E 43.35,68.2 38.6,68.2 35.1,71.7 IC8.7 35.35,73.95 35.35,78.45 | 43.35,85.45 39.6,85.45 35.35,81.2 35.35,78.45 | 43.35,85.45 X8.1 | 14.35,77.95 14.35,75.45 IC21.7 14.85,72.95 16.35,71.45 v21.1,71.45 | 10.1,82.2 8.6,83.7 8.6,85.45 X5.1 | 14.35,77.95 10.1,82.2 | R39.E 3.6,75.7 10.1,82.2 | 25.1,84.95 25.6,85.45 X6.1 | 25.1,84.95 21.35,84.95 16.6,80.2 16.6,79.7 14.85,77.95 14.35,77.95 | 35.35,78.45 31.35,78.45 25.35,84.45 25.1,84.95 | 55.6,74.2 55.1,74.45 54.6,74.45 50.6,78.45 49.35,78.45 43.6,84.2 43.6,84.95 43.35,85.45 | v41.85,51.95 45.1,48.7 45.6,48.45 | IC14.8 72.6,93.45 65.6,93.45 60.85,88.7 60.85,87.2 62.35,85.7 X9.1 | v63.1,80.95 v66.1,77.95 | 78.1,15.45 X7.1 78.1,15.95 81.1,18.95 81.6,18.95 R1.1 81.6,19.95 81.6,37.45 79.6,39.45 R2.1 79.1,39.95 75.6,39.95 X15.1 | X19.1 109.1,85.45 109.1,84.95 110.6,83.45 117.6,83.45 X20.1 119.6,83.45 121.6,85.45 126.1,85.45 X14.1
  Top 1.27: IC9.3 167.1,85.45 167.1,83.45 C1.1 167.1,82.45 167.1,80.2 167.1,78.45 C12.+
  Bottom 0.762: 99.35,37.45 97.6,35.7 97.6,22.2 100.1,19.7 | 100.1,19.7 106.35,13.45 107.85,13.45 C14.+ | 99.35,37.45 IC12.24 | IC16.14 132.1,34.2 102.6,34.2 99.35,37.45 | 100.1,19.7 91.35,10.95 87.85,10.95 86.1,12.7 86.1,14.95 82.1,18.95 R1.1 81.6,19.7 v77.85,23.45 | v150.85,80.2 144.35,80.2 141.6,77.45 126.6,77.45 121.35,82.7 119.85,82.7 X20.1 | v70.1,42.2 70.1,47.95 v68.1,49.95 | v72.1,63.2 72.1,66.2 76.35,70.45 83.6,70.45 v87.1,73.95
  Bottom 1.27: R40.2 49.35,18.7 52.85,18.7 54.35,20.2 63.1,20.2 64.85,18.45 R17.2 65.6,17.95 66.1,17.45 76.6,17.45 78.1,15.95 X7.1 | 72.85,70.2 70.6,67.95 69.85,67.95 R36.E | 72.85,70.2 75.1,70.2 76.6,71.7 IC19.7 | v58.85,77.45 62.6,81.2 | 62.6,81.2 62.6,85.45 X9.1 | IC17.7 14.85,57.7 16.35,56.2 17.85,56.2 19.35,57.7 IC17.5 | v21.1,71.45 23.6,68.95 23.6,68.2 R38.E | IC5.7 22.1,33.7 25.35,36.95 25.35,41.95 29.6,46.2 IC6.7 | v41.85,51.95 30.35,51.95 IC17.16 | v66.1,77.95 69.35,77.95 71.1,76.2 71.1,72.7 72.6,71.2 72.6,70.7 72.85,70.2 | 62.6,81.2 v63.1,80.95 | X15.1 73.1,39.95 70.1,39.95 66.6,43.45 64.6,43.45 63.1,44.95 IC4.6
+12V  (via drill 0.61)
  Top 0.762: v144.6,58.95 135.6,49.95 IC13.22
  Bottom 0.762: v144.6,58.95 151.85,58.95 172.1,79.2 178.6,79.2 185.1,85.7 186.35,85.7 188.35,87.7 188.35,91.45 190.6,93.7 192.1,93.7 | 192.1,93.7 193.35,92.45 IC11.1 | 193.1,95.2 193.1,94.7 192.1,93.7 | 193.1,95.2 193.1,96.45 C10.+ | C8.1 198.35,96.7 196.85,95.2 193.1,95.2
-5V  (via drill 0.61)
  Top 0.762: v182.1,80.7 176.6,80.7 162.1,95.2 v123.85,95.2 | v108.35,95.2 95.6,95.2 v88.6,88.2
  Top 1.27: IC21.4 20.1,67.45 22.35,69.7 26.6,69.7 28.1,68.2 R38.A | R37.A 48.6,67.2 48.6,64.7 47.1,63.2 45.6,63.2 44.35,64.45 40.6,64.45 IC8.4 39.85,63.95 39.35,63.45 v39.35,47.95 | v64.1,59.45 60.6,62.95 60.6,63.95 IC20.4 | IC10.OUT 206.6,86.45 206.6,87.45 R20.1 206.1,88.45 206.1,90.45 205.1,91.45 C2.2 205.1,96.45 C4.- | IC19.4 82.1,63.95 82.1,60.45 C6.2
  Bottom 0.762: v182.1,80.7 200.1,80.7 202.85,83.45 202.85,84.45 204.35,85.95 205.85,85.95 IC10.OUT | v108.35,95.2 v123.85,95.2 | v88.6,88.2 88.6,72.95 82.1,66.45 IC19.4
  Bottom 1.27: R7.A 10.1,26.2 12.1,28.2 IC5.4 14.6,28.2 17.6,28.2 19.35,26.45 22.6,26.45 23.85,27.7 27.85,27.7 29.35,26.2 R8.A 30.35,26.2 32.6,26.2 34.35,27.95 C17.- 35.6,28.7 37.1,30.2 37.1,31.7 36.85,31.95 36.85,35.7 | 36.85,35.7 35.35,37.2 35.35,38.7 IC6.4 35.35,40.95 35.35,43.95 v39.35,47.95 | C9.1 68.6,35.95 37.35,35.95 36.85,35.7 | R39.A 8.6,74.95 8.6,74.2 13.6,69.2 17.85,69.2 19.35,67.7 IC21.4 | 49.35,70.2 49.35,68.2 R37.A | 49.35,70.2 49.35,72.95 52.35,75.95 52.35,81.2 C13.2 | R38.A 28.85,67.2 28.85,65.2 31.35,62.7 38.6,62.7 39.85,63.95 IC8.4 | 49.35,70.2 61.85,70.2 63.85,68.2 R36.A 64.6,67.95 67.6,64.95 67.6,62.95 65.35,60.7 | 65.35,60.7 v64.1,59.45 | C6.2 81.6,59.95 81.6,58.95 79.1,56.45 69.6,56.45 65.35,60.7
A0  (via drill 0.61)
  Top 0.762: RN4.2 127.6,43.7 127.6,39.7 IC12.13 128.1,37.45 v144.35,37.45 | v153.1,33.45 153.1,35.45 v151.85,36.7
  Top 1.27: IC16.5 143.1,25.95 145.1,25.95 IC16.6 | RN4.2 127.6,45.95 127.6,47.45 IC13.19
  Bottom 0.762: v153.1,33.45 149.35,29.7 148.6,29.7 145.85,26.95 IC16.6 | v151.85,36.7 145.1,36.7 v144.35,37.45
A1
  Top 0.762: IC12.14 125.1,39.7 125.1,43.7 RN4.3
  Top 1.27: IC16.9 145.6,33.95 147.6,33.95 IC16.8 | RN4.3 125.1,45.95 125.1,47.45 IC13.18
  Bottom 0.762: IC16.9 144.85,34.45 144.85,34.7 138.6,40.95 126.6,40.95 125.35,39.7 IC12.14
CH0  (via drill 0.61)
  Top 1.27: v30.6,54.2 30.1,54.7 30.1,57.7 IC17.1
  Bottom 1.27: 11.47,61.83 11.6,61.7 18.85,61.7 21.6,64.45 21.6,68.2 16.85,72.95 IC21.6 | 11.47,61.83 8.35,64.95 6.35,64.95 R35.S | v30.6,54.2 13.35,54.2 10.1,57.45 10.1,60.45 11.47,61.83
CH1  (via drill 0.61)
  Top 1.27: 31.6,70.2 29.1,72.7 26.6,72.7 R34.S | v33.85,70.2 31.6,70.2 | v27.35,63.7 31.35,67.7 31.35,69.7 31.6,70.2
  Bottom 1.27: v33.85,70.2 35.85,70.2 37.35,71.7 IC8.6 | v27.35,63.7 27.35,60.2 IC17.2
CH2  (via drill 0.61)
  Top 1.27: v59.6,68.2 59.6,70.2 58.1,71.7 IC20.6 | v43.85,80.95 46.1,78.7 46.1,73.45 R33.S | v53.1,84.95 54.85,84.95 v57.1,82.7
  Bottom 1.27: v59.6,68.2 60.85,68.2 62.35,66.7 62.35,63.7 59.35,60.7 35.1,60.7 30.6,56.2 26.6,56.2 25.1,57.7 IC17.3 | v43.85,80.95 46.85,83.95 48.35,83.95 49.35,84.95 v53.1,84.95 | v57.1,82.7 57.1,79.2 56.6,78.7 56.6,74.95 57.6,73.95 IC20.6
CH3  (via drill 0.61)
  Top 1.27: v35.35,58.2 32.1,61.45 23.6,61.45 22.35,60.2 IC17.4 | v65.35,63.95 67.85,63.95 69.85,65.95 70.35,65.95 71.1,66.7 71.1,68.7 | 71.1,68.7 67.1,72.7 R32.S | IC19.6 79.1,71.7 76.35,68.95 71.6,68.95 71.1,68.7
  Bottom 1.27: v35.35,58.2 55.35,58.2 55.85,58.7 60.1,58.7 v65.35,63.95
CONTRASTO  (via drill 0.61)
  Top 0.762: v144.85,73.95 138.1,67.2 138.1,65.2 IC13.2 | v161.6,73.95 163.35,73.95 184.6,52.7 184.6,33.95 188.85,29.7 v188.85,19.2
  Bottom 0.762: v144.85,73.95 v161.6,73.95 | v188.85,19.2 188.85,17.7 194.1,12.45 194.1,11.45 X1.5
DATA0  (via drill 0.61)
  Top 0.762: v158.1,8.2 154.85,8.2 143.6,19.45 131.1,19.45 130.1,18.45 130.1,16.95 IC15.2 | v163.35,13.45 163.35,61.45 159.35,65.45 144.85,65.45 v131.6,52.2
  Top 1.27: IC13.16 120.1,47.45 120.1,45.95 RN4.5
  Bottom 0.762: v158.1,8.2 v163.35,13.45 | v131.6,52.2 122.6,52.2 120.35,49.95 IC13.16
DATA1  (via drill 0.61)
  Top 0.762: v131.6,17.95 135.6,17.95 148.35,5.2 160.1,5.2 v163.1,8.2 | v165.1,12.7 165.1,13.95 164.85,14.2 164.85,61.95 v154.35,72.45 | v137.1,73.7 132.35,73.7 v131.1,72.45
  Top 1.27: IC13.15 117.6,47.45 117.6,45.95 RN4.6 117.6,45.45
  Bottom 0.762: v131.6,17.95 126.85,17.95 125.6,16.7 IC15.4 | v163.1,8.2 163.1,10.7 v165.1,12.7 | v154.35,72.45 138.35,72.45 v137.1,73.7 | v131.1,72.45 111.85,72.45 108.6,69.2 108.6,62.7 117.1,54.2 117.1,49.95 IC13.15
DATA2  (via drill 0.61)
  Top 0.762: v100.1,17.7 v96.6,21.2
  Top 1.27: RN4.7 115.1,45.95 115.1,47.45 IC13.14
  Bottom 0.762: v100.1,17.7 107.6,10.2 115.1,10.2 119.6,14.7 IC15.6 | v96.6,21.2 96.1,21.7 96.1,38.2 100.6,42.7 113.6,42.7 114.6,43.7 RN4.7
DATA3  (via drill 0.61)
  Top 0.762: v96.1,17.7 v105.1,8.7
  Top 1.27: RN4.8 112.6,45.95 112.6,47.45 IC13.13
  Bottom 0.762: v105.1,8.7 116.85,8.7 IC15.8 | v96.1,17.7 94.35,17.7 93.1,18.95 93.1,37.2 100.1,44.2 111.85,44.2 RN4.8
DATA4  (via drill 0.61)
  Top 0.762: v197.6,17.7 v178.35,17.7 178.35,18.2 169.35,27.2 v169.35,43.7 169.35,65.95 v163.1,72.2 | v112.6,77.95 112.6,68.95 RN3.6 | v121.6,87.95 v118.6,84.95
  Top 1.27: IC13.12 112.6,64.95 112.6,66.95 RN3.6
  Bottom 0.762: v178.35,17.7 171.85,11.2 171.85,9.7 164.35,2.2 127.6,2.2 122.85,6.95 IC15.10 | v197.6,17.7 202.35,12.95 202.35,11.45 X1.8 | v169.35,43.7 168.35,44.7 158.85,44.7 SV3.14 | v112.6,77.95 112.6,79.95 117.6,84.95 v118.6,84.95 | v121.6,87.95 122.85,87.95 125.85,90.95 125.85,93.7 128.35,96.2 140.35,96.2 161.1,75.45 162.1,75.45 163.1,74.45 v163.1,72.2
DATA5  (via drill 0.61)
  Top 0.762: v151.85,45.2 154.85,45.2 SV3.13 | v169.85,11.2 171.85,11.2 176.85,16.2 | 176.85,16.2 v201.1,16.2 | v145.85,55.95 148.85,58.95 148.85,59.95 v152.85,63.95 | v160.85,69.95 167.85,62.95 167.85,25.2 176.85,16.2
  Top 1.27: IC13.11 115.1,64.95 115.1,66.95 RN3.5
  Bottom 0.762: v151.85,45.2 147.1,45.2 141.1,51.2 | 141.1,51.2 132.1,60.2 120.35,60.2 118.85,61.7 116.6,61.7 115.35,62.95 IC13.11 | v169.85,11.2 169.85,9.7 163.85,3.7 131.1,3.7 127.85,6.95 IC15.12 | v201.1,16.2 205.1,12.2 205.1,11.45 X1.9 | v152.85,63.95 154.85,63.95 v160.85,69.95 | v145.85,55.95 141.1,51.2
DATA6  (via drill 0.61)
  Top 0.762: 153.85,57.45 153.85,49.2 155.1,47.95 SV3.11 | 153.85,57.45 153.85,60.95 155.1,62.2 158.6,62.2 159.85,60.95 159.85,44.2 158.6,42.95 SV3.16 | v117.6,60.2 117.6,62.7 IC13.10 | v136.1,58.7 v131.6,58.7 | 153.85,57.45 v153.6,57.45
  Top 1.27: IC13.10 117.1,64.95 117.1,66.95 RN3.4
  Bottom 0.762: IC16.2 135.6,26.95 139.85,31.2 148.85,31.2 153.85,36.2 153.85,45.7 155.1,46.95 SV3.11 | X1.10 207.85,11.45 193.1,26.2 189.1,26.2 173.1,42.2 158.85,42.2 SV3.16 | v117.6,60.2 118.35,60.2 119.85,58.7 v131.6,58.7 | v136.1,58.7 142.85,58.7 144.1,57.45 v153.6,57.45
DATA7  (via drill 0.61)
  Top 0.762: v148.1,63.7 v145.1,63.7 | SV3.15 154.85,42.7 152.35,42.7 150.35,44.7 150.35,59.45 v151.35,60.45 154.85,63.95 158.85,63.95 161.85,60.95 161.85,9.7 | v146.35,18.95 153.85,11.45 153.85,11.2 155.35,9.7 161.85,9.7 | 161.85,9.7 172.35,9.7 175.35,12.7 209.1,12.7 210.6,11.2 X1.11
  Top 1.27: IC13.9 120.1,64.95 120.1,66.95 RN3.3
  Bottom 0.762: v151.35,60.45 v148.1,63.7 | v145.1,63.7 143.1,63.7 141.1,61.7 121.6,61.7 120.35,62.95 IC13.9 | v146.35,18.95 140.6,24.7 IC16.4
DB0  (via drill 0.61)
  Top 0.762: v105.35,19.45 105.35,11.95 113.1,4.2 131.85,4.2 134.35,6.7 134.35,9.7 132.85,11.2 132.85,14.45 IC15.1
  Bottom 0.762: v105.35,19.45 105.35,20.7 106.85,22.2 IC12.4
DB1  (via drill 0.61)
  Top 0.762: v112.6,11.7 113.1,11.2 v123.6,11.2
  Bottom 0.762: v112.6,11.7 112.1,12.2 112.1,14.7 110.1,16.7 110.1,22.2 IC12.5 | v123.6,11.2 127.1,14.7 IC15.3
DB2
  Bottom 0.762: IC12.6 112.85,22.2 116.85,18.2 119.85,18.2 120.1,17.95 120.85,17.95 122.1,16.7 IC15.5
DB3  (via drill 0.61)
  Top 0.762: v108.6,20.2 112.6,20.2 114.6,22.2 IC12.7 | v106.85,16.7 106.85,12.45 113.6,5.7 118.35,5.7 119.6,6.95 IC15.9
  Bottom 0.762: v108.6,20.2 108.6,18.45 v106.85,16.7
DB4
  Bottom 0.762: IC15.11 125.6,8.95 125.6,9.2 129.85,13.45 133.6,13.45 134.35,14.2 134.35,17.2 132.1,19.45 120.6,19.45 117.85,22.2 IC12.8
DB5  (via drill 0.61)
  Top 0.762: v128.85,32.7 131.1,34.95 131.1,35.2 131.6,35.7 148.85,35.7 149.6,34.95 v149.6,27.45 | v135.35,5.7 v138.1,8.45
  Bottom 0.762: v128.85,32.7 128.6,32.7 120.35,24.45 IC12.9 | v149.6,27.45 149.6,19.95 v138.1,8.45 | v135.35,5.7 131.85,5.7 130.6,6.95 IC15.13
DB6
  Bottom 0.762: IC12.10 123.1,24.2 123.1,24.45 124.35,25.7 132.1,25.7 IC16.1
DB7
  Bottom 0.762: IC12.11 125.6,22.45 125.6,22.2 126.85,20.95 133.85,20.95 137.6,24.7 IC16.3
DIM1
  Top 0.762: IC13.1 140.85,64.95 143.85,67.95 X2.1
DIM2
  Top 0.762: X3.1 140.35,44.95 140.35,47.45 IC13.24
DIM3  (via drill 0.61)
  Top 0.762: v134.6,52.95 136.1,52.95 143.6,60.45 X4.1
  Bottom 0.762: 135.1,52.95 135.35,52.45 137.35,50.45 137.6,49.95
  Bottom 1.27: IC13.23 137.6,49.95 | 135.1,52.95 v134.6,52.95
E  (via drill 0.61)
  Top 0.762: v151.6,17.95 151.6,34.95 150.35,36.2 150.35,37.2 152.85,39.7 154.85,39.7 SV3.17 | v163.35,5.2 v169.35,5.2 | v177.35,14.7 v193.85,14.7
  Bottom 0.762: v151.6,17.95 151.6,12.7 159.1,5.2 v163.35,5.2 | v169.35,5.2 173.35,9.2 173.35,10.7 v177.35,14.7 | v193.85,14.7 197.1,11.45 X1.6
GND  (via drill 0.61)
  Top 0.762: X3.2 143.1,44.95 143.1,55.45 146.35,58.7 146.35,60.2 X4.2 | 147.1,82.95 146.35,83.7 146.35,84.95 J1.1 | 147.1,82.95 147.1,74.2 145.35,72.45 145.1,71.95 | C1.2 163.85,82.95 147.1,82.95 | IC19.3 79.6,66.45 79.6,67.45 83.6,71.45 83.6,76.45 80.85,79.2 X18.1 | 148.35,22.45 148.35,19.2 155.1,12.45 SV3.39 | 148.35,22.45 148.35,24.7 IC16.7 | IC12.3 105.1,24.45 106.85,26.2 106.85,37.45 IC12.21 107.1,39.7 107.1,45.2 91.35,60.95 SV2.2 | C14.- 109.35,15.7 113.1,15.7 C5.2 114.1,15.7 116.85,15.7 IC15.7 117.85,16.7 119.1,17.95 122.85,17.95 127.1,22.2 127.1,22.45 IC12.12 128.1,22.45 148.35,22.45 | 105.1,21.45 105.6,21.2 108.35,18.45 108.6,17.95
  Top 1.27: 15.35,56.2 13.85,56.2 12.35,57.7 IC17.8 | 15.35,56.2 16.85,57.7 IC17.6 17.35,60.2 17.35,65.2 IC21.3 | 18.35,42.45 18.35,48.7 19.6,49.95 IC17.12 | 18.35,42.45 18.35,34.95 14.6,31.2 IC5.3 | IC17.13 21.6,51.45 20.1,51.45 IC17.12 | 15.35,56.2 15.85,55.95 19.35,52.45 IC17.12 | 53.22,30.07 50.35,32.95 IC7.4 50.35,34.2 50.35,40.45 IC7.5 | 53.22,30.07 54.6,28.7 R16.1 55.6,27.95 59.22,24.32 | 59.22,24.32 59.85,23.7 59.85,18.7 R23.1 | 43.35,23.7 43.35,18.7 R15.1 | 43.35,23.7 39.1,27.95 R13.1 38.1,28.7 37.6,28.7 35.6,30.7 C17.+ 34.6,31.7 32.6,33.7 32.6,38.7 IC6.3 32.6,40.95 | 32.6,40.95 37.35,45.7 37.35,63.95 IC8.3 | 53.22,30.07 47.1,23.95 43.85,23.95 43.35,23.7 | 18.35,42.45 30.85,42.45 32.1,41.2 32.6,40.95 | IC20.3 57.85,63.95 57.85,58.2 58.6,57.45 58.6,55.45 58.1,54.95 IC4.13 58.35,53.95 59.85,53.95 IC4.12 60.6,52.7 60.6,51.95 65.1,47.45 IC4.7 | C9.2 68.6,33.45 66.1,33.45 IC18.4 65.35,34.2 65.35,40.45 IC18.5 65.6,41.7 65.6,44.95 IC4.7 | X15.2 74.35,42.95 74.6,43.45 74.6,43.95 74.35,44.45 X15.3 73.1,44.95 68.1,44.95 IC4.8 | IC4.7 65.85,46.2 67.35,46.2 IC4.8 | v61.35,26.45 59.22,24.32 | IC14.4 80.85,84.45 80.85,81.7 X18.1 | v57.1,85.45 57.1,86.95 55.1,88.95 55.1,91.95 61.1,97.95 86.1,97.95 87.6,96.45 87.6,94.45 v86.6,93.45 | IC13.7 125.6,63.95 127.1,63.95 IC13.6 | SV2.1 88.6,61.45 90.1,61.45 SV2.2 | IC19.3 79.6,63.95 79.6,60.45 C6.1 79.1,59.95 79.1,58.45 68.1,47.45 IC4.8 | 202.6,94.95 202.6,96.45 C4.+ | 202.6,94.95 202.6,92.45 C2.1 | C3.2 187.6,96.95 191.1,96.95 C10.- 191.1,96.45 192.6,94.95 194.6,94.95 195.85,96.2 | 195.85,96.2 196.1,96.45 C8.2 | 197.1,94.95 202.6,94.95
  Top 1.27: 197.1,94.95 195.85,96.2 | 191.1,88.45 191.1,84.95 R19.2 191.6,83.95 191.6,72.45 TR1.5 194.1,71.45 206.1,71.45 TR1.4 | 191.1,88.45 192.1,89.45 IC11.2 192.6,89.95 194.6,89.95 197.1,92.45 197.1,94.95 | C11.- 186.6,88.45 191.1,88.45 | IC13.3 135.6,64.95 135.6,65.95 Q2.E 136.1,65.95 | 145.1,71.95 146.1,70.95 146.1,69.95 X2.2 | IC12.2 102.6,23.45 104.6,23.45 IC12.3 105.1,22.45 105.1,21.45 | 108.6,17.95 108.6,16.45 C14.- | SV3.39 156.1,11.95 157.6,11.95 SV3.40 | IC12.12 127.6,24.45 | IC9.2 164.6,85.45 164.6,83.45 C1.2 164.6,82.45 | C12.- 164.6,78.45 | X1.12 214.6,10.95 216.1,10.95 X1.13 | 214.1,7.95 214.6,7.95 X1.25 | 214.1,7.95 213.1,7.95 X1.24 212.1,7.95 210.1,7.95 X1.23 209.1,7.95 207.6,7.95 X1.22 206.6,7.95 204.6,7.95 X1.21 203.6,7.95 202.1,7.95 X1.20 200.6,7.95 199.1,7.95 X1.19 198.1,7.95 196.6,7.95 X1.18 195.1,7.95 193.6,7.95 X1.17 192.6,7.95 191.1,7.95 X1.16 189.6,7.95 | X1.14 185.6,7.95 187.1,7.95 X1.15 188.1,7.95 189.6,7.95 | 189.6,7.95 189.6,10.45 X1.3 | X1.12 214.1,10.45 214.1,7.95 | v213.6,21.95 213.6,11.45 X1.12
  Bottom 0.762: IC13.6 128.1,64.95 129.35,66.2 134.1,66.2 Q2.E 136.35,66.7 145.1,66.7 | C12.- 164.6,78.7 164.6,79.2 165.85,80.45 166.1,80.95 | 145.1,66.7 146.35,67.95 X2.2 | X4.2 146.6,62.7 146.6,65.2 145.1,66.7 | SV2.1 87.6,61.7 82.6,61.7 82.35,61.95 80.85,61.95 79.6,60.7 C6.1 | X1.14 184.1,8.2 183.35,8.2 179.85,11.7 179.85,18.2 178.85,19.2 165.85,19.2 158.85,12.2 SV3.40
  Bottom 1.27: v61.35,26.45 63.35,28.45 63.35,30.95 65.1,32.7 IC18.4 | v57.1,85.45 56.6,85.45 55.1,83.95 55.1,81.95 C13.1 | v86.6,93.45 84.6,93.45 81.1,89.95 81.1,86.45 IC14.4 | C1.2 164.6,82.45 166.1,80.95 177.1,80.95 183.6,87.45 185.6,87.45 C11.- | v213.6,21.95 209.1,26.45 209.1,68.95 208.1,69.95 TR1.4
LDAC
  Top 0.762: IC13.8 122.35,62.7 110.6,50.95 110.6,43.45 113.1,40.95 118.35,40.95 119.6,39.7 IC12.16
  Top 1.27: IC16.13 135.6,33.95 137.6,33.95 IC16.12 | RN3.2 122.6,66.95 122.6,64.95 IC13.8
  Bottom 0.762: IC12.16 120.6,37.7 120.6,37.45 122.35,35.7 133.6,35.7 134.85,34.45 IC16.13
N$1  (via drill 0.61)
  Top 0.762: v112.35,32.7 117.1,37.45 IC12.17 | v99.35,35.45 98.1,36.7 v98.1,46.7 | v115.85,73.95 119.35,70.45 R21.1
  Bottom 0.762: v112.35,32.7 102.1,32.7 v99.35,35.45 | v98.1,46.7 98.1,60.7 111.35,73.95 v115.85,73.95
N$2
  Top 1.27: X16.1 218.1,31.95 218.1,37.95 213.6,42.45 TR1.2
N$3
  Top 1.27: F1.2 190.6,31.95 190.6,40.45 188.6,42.45 TR1.1
N$4
  Top 1.27: R9.1 39.35,43.45 39.85,43.45 41.85,41.45 IC7.8
N$5
  Top 1.27: R9.2 39.35,33.45 41.85,33.45 IC7.1
N$6
  Top 1.27: R10.1 54.6,43.45 55.1,43.45 57.1,41.45 IC18.8
N$7
  Top 1.27: R10.2 54.6,33.45 57.1,33.45 IC18.1
N$8  (via drill 0.61)
  Top 0.762: v93.6,53.2 v105.6,41.2
  Bottom 0.762: v105.6,41.2 110.6,41.2 112.1,39.7 IC12.19 | v93.6,53.2 93.6,85.45 X17.2
N$9  (via drill 0.61)
  Top 1.27: v16.35,39.2 12.85,39.2 9.85,36.2 7.6,36.2 R6.S | v37.35,38.95 37.35,37.95 v34.6,35.2
  Bottom 1.27: v16.35,39.2 18.35,37.2 18.35,32.7 19.85,31.2 IC5.6 22.1,31.2 30.6,31.2 v34.6,35.2 | v37.35,38.95 43.6,45.2 49.6,45.2 IC4.1
N$10  (via drill 0.61)
  Top 1.27: v22.6,40.45 22.85,40.45 26.85,36.45 R5.S | v22.6,44.45 30.35,44.45 32.1,46.2 IC6.6
  Bottom 1.27: v22.6,44.45 v22.6,40.45 | IC4.2 52.6,47.45 50.1,49.95 33.85,49.95 32.6,48.7 IC6.6
N$11  (via drill 0.61)
  Top 0.762: v108.6,77.95 108.6,43.45 109.6,42.45 109.6,39.7 IC12.20
  Bottom 0.762: v108.6,77.95 108.6,83.45 110.6,85.45 X19.2
N$13
  Bottom 1.27: IC4.3 55.6,45.2 55.6,44.95 55.85,44.7 55.85,42.7 54.85,41.7 52.6,41.7 51.1,43.2 49.1,43.2 48.1,42.2 48.1,41.7 IC7.6
N$22
  Bottom 1.27: IC4.4 58.1,44.95 59.85,43.2 61.35,43.2 62.35,42.2 62.35,41.7 IC18.6
N$26
  Top 0.762: R21.2 130.6,69.95 133.6,69.95 134.1,69.45 Q2.B
N$27
  Bottom 0.762: X20.2 119.85,80.2 121.85,80.2 128.1,73.95 131.6,73.95 133.6,71.95 134.1,71.95 Q2.C
N$31
  Bottom 1.27: R12.1 22.85,20.95 24.85,20.95 26.85,22.95 R8.S
N$35
  Bottom 1.27: B1.AC1 219.1,91.95 218.6,91.95 201.1,74.45 190.6,74.45 188.6,72.45 TR1.6
N$40
  Top 0.762: R22.2 132.6,75.95 132.6,80.2 Q3.3
N$51  (via drill 0.61)
  Top 0.762: v108.35,31.2 114.6,37.45 IC12.18 | v99.1,33.7 96.6,36.2 v96.6,48.2
  Bottom 0.762: v108.35,31.2 101.6,31.2 v99.1,33.7 | v96.6,48.2 96.6,61.2 110.85,75.45 122.1,75.45 R22.1
N$58
  Top 1.27: R3.2 R4.2 | R6.E 10.1,33.45 12.1,33.45 IC5.2
  Bottom 1.27: R3.2 14.1,17.95 6.85,17.95 5.1,16.2 3.6,16.2 2.6,17.2 2.6,27.2 8.85,33.45 R6.E
N$60
  Top 1.27: R3.1 5.1,18.2 5.35,18.2 7.85,15.7 X13.2
N$61
  Top 1.27: X14.2 129.1,85.45 129.1,84.95 130.1,83.95 130.1,82.95 Q3.2
N$62
  Top 1.27: R4.1 5.1,20.95 6.85,22.7 R7.S
N$63
  Top 1.27: R11.2 32.6,18.7 32.6,20.2 R12.2 32.35,21.45 32.35,30.7 30.1,32.95 R5.E 29.85,33.95 29.85,38.7 IC6.2
N$66
  Top 1.27: 47.6,28.45 48.35,28.45 R40.1 | 47.6,28.45 44.35,28.45 R15.2 | IC7.3 47.6,32.7 47.6,28.45
N$67
  Bottom 1.27: IC10.IN 208.1,84.45 219.1,95.45 219.1,95.95 B1.-
N$68
  Top 1.27: R13.2 39.35,17.95 41.85,15.45 X11.2
  Bottom 1.27: IC7.2 44.85,32.7 44.85,32.2 40.6,27.95 40.6,20.2 39.1,18.7 R13.2
N$69
  Top 1.27: R11.1 22.85,17.95 25.35,15.45 X12.2
N$70
  Top 0.762: 156.1,60.45 157.6,60.45
  Top 1.27: SV3.1 156.1,60.45 | 157.6,60.45 SV3.2
N$71
  Top 1.27: SV2.39 88.6,13.45 90.1,13.45 SV2.40
N$74
  Top 1.27: X18.2 IC14.3
N$76  (via drill 0.61)
  Top 1.27: 187.1,91.95 187.1,91.45 186.6,90.95 C11.+ | 187.1,91.95 187.1,93.95 C3.1 | IC11.3 190.6,91.95 187.1,91.95 | v197.1,82.45 208.6,82.45 210.6,84.45 219.1,84.45 B1.+
  Bottom 1.27: v197.1,82.45 190.1,89.45 190.1,90.95 191.1,91.95 IC11.3 | IC9.1 162.1,88.45 162.1,88.95 163.6,90.45 185.6,90.45 C11.+
N$77
  Top 1.27: R20.2 196.6,87.95 198.1,87.95 201.1,84.95 R19.1 201.6,84.45 204.6,84.45 IC10.ADJ
N$80
  Bottom 1.27: B1.AC2 219.1,88.45 219.1,87.45 213.6,81.95 213.6,72.45 TR1.3
N$83
  Top 1.27: Q1.1 73.1,83.45 73.1,84.45 IC14.1
N$84
  Top 1.27: Q1.2 73.85,78.45 73.85,80.45 75.35,81.95 75.35,84.45 IC14.2
N$85
  Top 1.27: X16.2 218.1,26.45 218.1,27.45 216.1,29.45 207.6,29.45 F1.1
N$107
  Top 1.27: 62.85,28.45 64.85,28.45 R17.1 | 62.85,28.45 60.85,28.45 R23.2 | IC18.3 62.85,32.7 62.85,28.45
N$110
  Top 1.27: R16.2 55.85,17.95 56.35,17.95 58.6,15.7 X10.2
  Bottom 1.27: IC18.2 60.1,32.7 60.1,30.95 57.1,27.95 57.1,27.45 50.35,20.7 48.6,20.7 46.85,18.95 46.85,17.45 48.1,16.2 53.1,16.2 54.85,17.95 R16.2
N$113  (via drill 0.61)
  Top 1.27: R24.2 59.1,82.45 59.1,80.95 R25.2 59.35,79.95 63.6,75.7 R32.E 63.85,74.95 63.85,72.95 62.1,71.2 62.1,66.95 62.6,66.45 62.6,63.95 68.1,58.45 v71.35,58.45
  Bottom 1.27: v71.35,58.45 73.6,60.7 73.6,60.95 76.6,63.95 IC19.2
N$114
  Top 1.27: IC20.2 55.1,66.45 50.6,70.95 45.35,70.95 44.1,72.2 44.1,74.95 R33.E 43.6,75.95 43.6,76.7 40.35,79.95 R26.2 40.1,80.95 40.1,82.45 R27.2
N$115
  Top 1.27: R29.2 22.35,82.45 22.35,80.95 R28.2 22.6,79.95 23.35,79.2 23.35,75.95 R34.E
  Bottom 1.27: IC8.2 34.6,66.45 34.6,66.7 30.35,70.95 30.35,76.45 29.35,77.45 25.85,77.45 24.1,75.7 R34.E
N$116  (via drill 0.61)
  Top 1.27: R30.2 4.6,80.95 4.6,82.45 R31.2 | 10.1,69.7 12.35,69.7 14.35,67.7 IC21.2 | 10.1,69.7 7.35,69.7 5.6,67.95 3.85,67.95 R35.E | v10.1,76.45 10.1,69.7
  Bottom 1.27: v10.1,76.45 6.1,80.45 5.1,80.45 R30.2
N$117
  Top 1.27: R31.1 14.1,83.45 13.6,83.45 11.35,85.7 X5.2
N$119
  Top 1.27: R29.1 31.85,83.2 31.6,83.2 29.1,85.7 X6.2
N$121
  Bottom 1.27: R39.S 5.6,73.45 5.6,76.45 2.6,79.45 2.6,83.95 3.6,84.95 6.35,84.95 10.6,80.7 14.1,80.7 R30.1
N$122
  Bottom 1.27: R38.S 25.6,65.7 25.6,70.45 21.6,74.45 21.6,76.2 25.6,80.2 31.85,80.2 R28.1
N$123
  Bottom 1.27: R37.S 46.1,65.7 46.1,70.2 41.85,74.45 41.85,76.2 45.85,80.2 49.6,80.2 R26.1
N$124
  Top 1.27: R27.1 49.6,83.2 49.1,83.2 46.85,85.45 X8.2
N$125
  Bottom 1.27: R24.1 68.6,83.2 68.1,83.2 65.85,85.45 X9.2
N$126
  Bottom 1.27: R36.S 66.1,70.45 66.1,70.7 62.35,74.45 62.35,76.95 65.6,80.2 68.6,80.2 R25.1
RS
  Bottom 0.762: SV3.18 158.85,39.7 171.6,39.7 199.6,11.7 199.6,11.45 X1.7
SCL  (via drill 0.61)
  Top 0.762: v185.85,21.45 185.85,30.7 v170.85,45.7 | v154.35,78.7 v164.1,68.95 | IC12.22 104.35,37.45 104.35,31.2 92.6,19.45 92.6,12.45 91.6,11.45 87.35,11.45 82.22,16.57 | v73.1,49.7 78.85,49.7 R2.2 | v48.85,87.95 47.1,89.7 45.35,89.7 44.1,88.45 X8.4 | X5.4 7.6,87.7 6.6,87.7 1.6,82.7 1.6,65.2 14.35,52.45 IC17.10 | v83.6,95.2 81.85,95.2 81.1,95.95 v80.35,95.95
  Top 1.27: X5.4 8.6,88.45 8.6,88.7 10.35,90.45 11.6,90.45 14.85,87.2 24.6,87.2 25.35,87.95 X6.4 26.1,88.45 27.6,89.95 29.6,89.95 32.1,87.45 40.6,87.45 41.1,87.95 43.6,87.95 X8.4 | IC17.10 14.6,48.2 1.85,35.45 1.85,16.7 7.6,10.95 8.85,10.95 10.6,12.7 X13.4 11.35,12.95 13.6,12.95 14.6,13.95 22.6,13.95 25.6,10.95 26.6,10.95 28.35,12.7 X12.4 29.1,12.95 31.35,12.95 32.35,13.95 39.1,13.95 42.1,10.95 43.1,10.95 44.85,12.7 X11.4 | SV2.13 87.6,46.45 82.6,46.45 79.6,49.45 R2.2 | v84.1,35.45 84.1,18.45 82.22,16.57 78.6,12.95 X7.4
  Bottom 0.762: 124.6,86.45 124.6,86.7 125.85,87.95 X14.4 | 124.6,86.45 124.6,81.45 127.1,78.95 141.1,78.95 144.6,82.45 J1.2 145.35,82.7 150.35,82.7 v154.35,78.7 | v185.85,21.45 185.85,11.45 X1.2 | v170.85,45.7 170.85,62.2 v164.1,68.95 | v73.1,49.7 71.35,51.45 67.1,51.45 65.85,52.7 IC4.10 | X7.4 77.85,12.7 76.85,11.7 74.6,11.7 73.1,13.2 62.1,13.2 X10.4 61.35,12.7 60.35,11.7 57.1,11.7 55.6,13.2 45.6,13.2 X11.4 | v48.85,87.95 62.35,87.95 X9.4 63.35,88.45 64.6,89.7 66.1,89.7 67.85,87.95 73.35,87.95 77.6,92.2 IC14.6 78.6,94.2 v80.35,95.95 | v83.6,95.2 106.35,95.2 115.1,86.45 124.6,86.45
  Bottom 1.27: v84.1,35.45 84.1,42.95 87.1,45.95 87.6,45.95 SV2.13
SDA  (via drill 0.61)
  Top 0.762: 78.85,90.45 76.35,87.95 65.85,87.95 X9.3 65.85,88.45 v65.85,91.2 | 78.85,90.45 80.35,91.95 IC14.5 | v89.35,96.7 120.35,96.7 128.6,88.45 X14.3 | v94.6,23.45 101.85,30.7 101.85,37.45 IC12.23 | 94.6,12.45 v94.6,19.45 | 94.6,12.45 90.1,7.95 80.6,7.95 75.85,12.7 X7.3 | X1.1 182.6,10.45 182.1,10.45 174.35,2.7 104.35,2.7 94.6,12.45 | v75.6,51.2 85.6,61.2 85.6,83.7 78.85,90.45
  Top 1.27: v16.35,25.2 v16.35,30.2 | v45.85,10.95 48.35,13.45 58.6,13.45 X10.3 59.1,12.95 60.6,11.45 62.6,11.45 67.1,15.95 72.1,15.95 | 72.1,15.95 72.1,18.95 R1.2 | 72.1,15.95 75.1,12.95 X7.3 | J1.3 143.1,85.95 132.1,85.95 130.1,87.95 129.1,87.95 X14.3
  Bottom 0.762: X5.3 11.35,87.95 23.6,87.95 25.35,89.7 26.85,89.7 28.1,88.45 X6.3 29.1,87.95 40.1,87.95 41.85,89.7 44.6,89.7 45.35,88.95 | 45.35,88.95 45.85,88.45 X8.3 | v89.35,96.7 83.1,96.7 80.85,94.45 IC14.5 | v65.85,91.2 63.85,93.2 49.6,93.2 45.35,88.95 | v94.6,19.45 v94.6,23.45 | 74.6,50.2 82.35,42.45 82.35,34.95 84.47,32.83 | 74.6,50.2 71.85,52.95 68.6,52.95 IC4.9 | 74.6,50.2 v75.6,51.2
  Bottom 1.27: v16.35,30.2 16.35,36.45 12.1,40.7 12.1,49.95 IC17.9 | v16.35,25.2 16.35,21.95 19.47,18.82 | 19.47,18.82 20.35,17.95 20.35,17.2 24.1,13.45 25.35,13.45 X12.3 26.35,12.7 27.6,11.45 29.6,11.45 31.6,13.45 41.85,13.45 X11.3 42.85,12.7 44.6,10.95 v45.85,10.95 | X13.3 8.6,12.7 8.6,12.45 9.6,11.45 12.1,11.45 19.47,18.82 | SV2.21 87.6,35.95 84.47,32.83 71.6,19.95 R1.2
VCC  (via drill 0.61)
  Top 0.762: v145.6,78.7 142.6,81.7 142.6,82.45 J1.4 | v161.85,66.95 v150.1,78.7 | v166.35,38.2 v166.35,46.2
  Bottom 0.762: v150.1,78.7 v145.6,78.7 | v161.85,66.95 161.85,51.2 161.6,50.95 | 161.6,50.95 SV3.12 | v166.35,38.2 171.1,38.2 187.35,21.95 187.35,17.2 191.35,13.2 191.35,11.45 X1.4 | v166.35,46.2 161.6,50.95
WR  (via drill 0.61)
  Top 0.762: v144.6,28.45 144.6,30.7 143.35,31.95 143.1,32.45 | 129.6,29.95 122.85,36.7 122.85,36.95 122.6,37.45 | 129.6,29.95 v129.6,28.45 | IC16.11 139.85,32.45 137.6,30.2 129.85,30.2 129.6,29.95
  Top 1.27: IC16.11 140.6,33.95 142.6,33.95 IC16.10 143.1,32.45 | 122.6,37.45 IC12.15 | RN4.4 122.6,45.95 122.6,47.45 IC13.17
  Bottom 0.762: 122.6,39.45 122.6,43.95
  Bottom 1.27: 122.6,43.95 RN4.4 | IC12.15 122.6,39.45